# Altium project BLDC Motor Driver.PrjPcb (part 1 of 2)
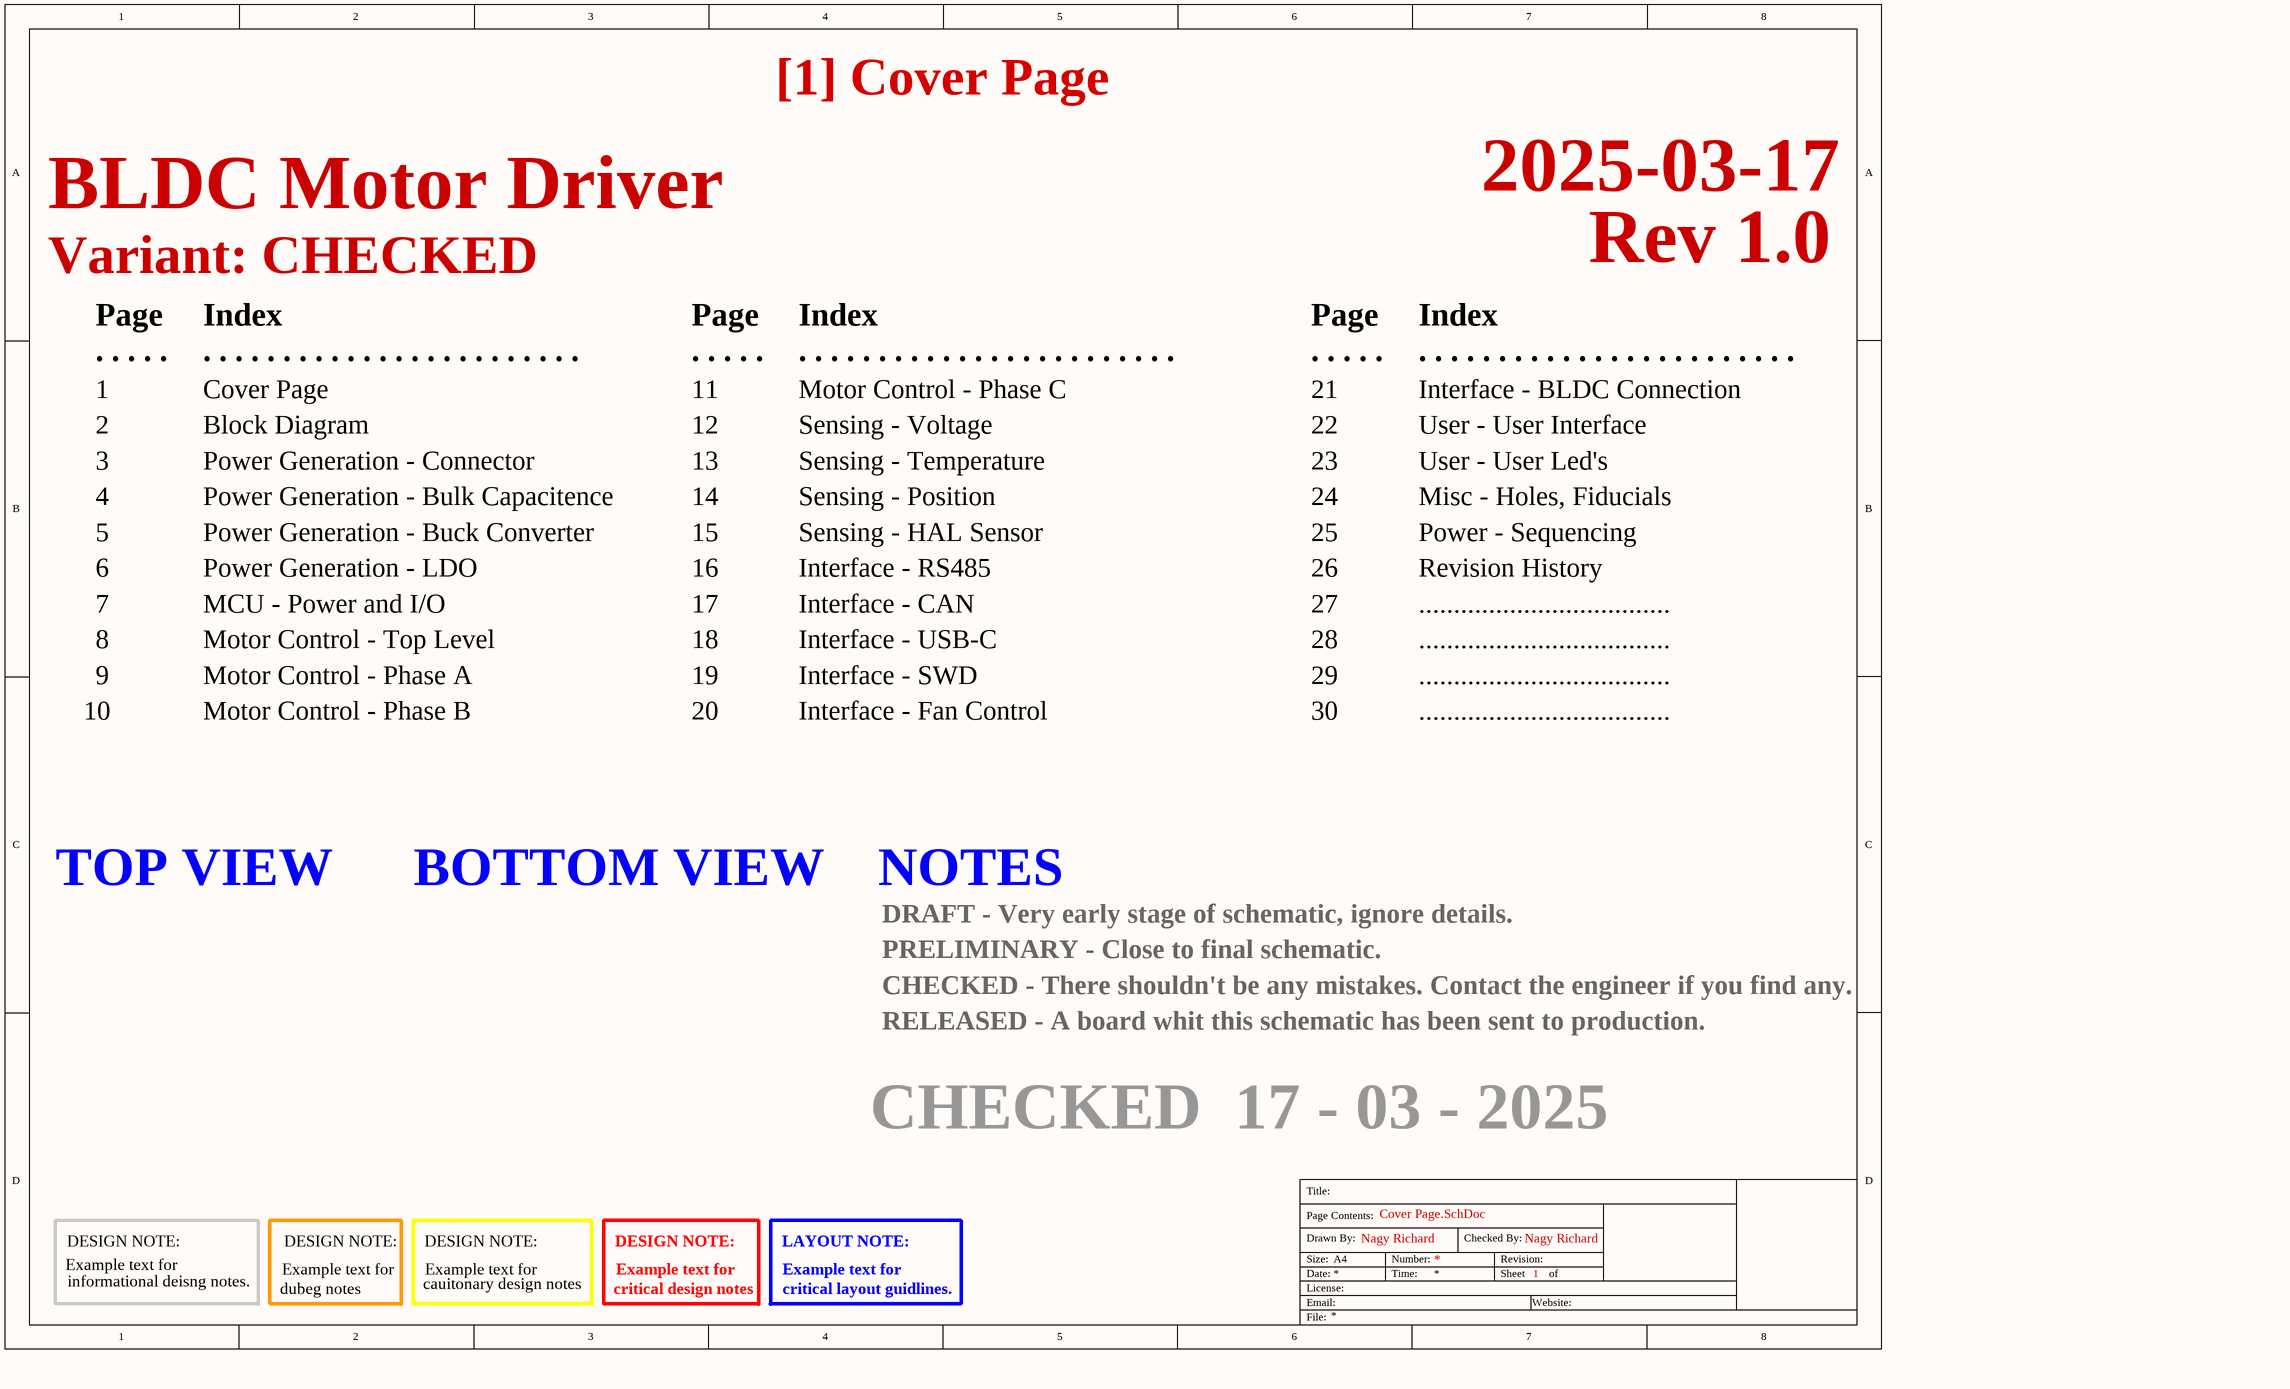
[diagram p0: Cover Page.SchDoc]
24 sheets, 253 parts. Net scope: global (net labels, ports and power ports of the same name join across sheets).
Board file: PCB.PcbDoc
Sheets:
  Cover Page.SchDoc
  Block Diagram.SchDoc
    U_Power Generation - Connector = Power Generation - Connector.SchDoc
    U_Power Generation - Buck Converter = Power Generation - Buck Converter.SchDoc
    U_Power Generation - LDO = Power Generation - LDO.SchDoc
    U_MCU - Power and I_O = MCU - Power and I_O.SchDoc
    U_Motor Control - Top Level = Motor Control - Top Level.SchDoc
    U_Motor Control - Phase A = Motor Control - Phase A.SchDoc
    U_Motor Control - Phase B = Motor Control - Phase B.SchDoc
    U_Motor Control - Phase C = Motor Control - Phase C.SchDoc
    U_Sensing - Voltage = Sensing - Voltage.SchDoc
    U_Sensing - Temperature = Sensing - Temperature.SchDoc
    U_Sensing - HAL Sensor = Sensing - HAL Sensor.SchDoc
    U_Interface - RS485 = Interface - RS485.SchDoc
    U_Interface - CAN = Interface - CAN.SchDoc
    U_Interface - USB-C = Interface - USB-C.SchDoc
    U_Interface - SWD = Interface - SWD.SchDoc
    U_Interface - Fan Control = Interface - Fan Control.SchDoc
    U_Interface - BLDC Connection = Interface - BLDC Connection.SchDoc
    U_User - User Interface = User - User Interface.SchDoc
    U_User - User Led's = User - User Led's.SchDoc
  Misc - Holes, Fiducials.SchDoc
  Power - Sequencing.SchDoc
  Revision History.SchDoc

## Sheet Cover Page.SchDoc: [1] Cover Page
size A3; ApprovedBy: Nagy Richard; CheckedBy: Nagy Richard; Author: Nagy Richard; CompanyName: EmbedCore; DrawnBy: Nagy Richard; Engineer: Nagy Richard; Organization: EmbedCore; Revision: 1.0; SheetNumber: 1; SheetTotal: 24; ImagePath: .\Logo\EmbedCore.png

### Notes on the sheet
- BLDC Motor Driver
- 2025-03-17
- Variant: CHECKED
- Rev 1.0
- Page
- Index
- . . . . .
- 1
- . . . . . . . . . . . . . . . . . . . . . . . .
- Cover Page
- 11
- Motor Control - Phase C
- 21
- Interface - BLDC Connection
- 2
- Block Diagram
- 12
- Sensing - Voltage
- 22
- User - User Interface
- 3
- 4
- Power Generation - Connector
- Power Generation - Bulk Capacitence
- 13
- 14
- Sensing - Temperature
- Sensing - Position
- 23
- 24
- User - User Led's
- Misc - Holes, Fiducials
- 5
- 6
- Power Generation - Buck Converter
- Power Generation - LDO
- 15
- 16
- Sensing - HAL Sensor
- Interface - RS485
- 25
- 26
- Power - Sequencing
- Revision History
- 7
- MCU - Power and I/O
- 17
- Interface - CAN
- 27
- ....................................
- 8
- 9
- Motor Control - Top Level
- Motor Control - Phase A
- 18
- 19
- Interface - USB-C
- Interface - SWD
- 28
- 29
- 10
- Motor Control - Phase B
- 20
- Interface - Fan Control
- 30
- TOP VIEW
- BOTTOM VIEW
- NOTES
- DRAFT - Very early stage of schematic, ignore details.
- CHECKED - There shouldn't be any mistakes. Contact the engineer if you find any.
- PRELIMINARY - Close to final schematic.
- RELEASED - A board whit this schematic has been sent to production.
- CHECKED  17 - 03 - 2025
- DESIGN NOTE:
- LAYOUT NOTE:
- Example text for
- informational deisng notes.
- dubeg notes
- cauitonary design notes
- critical design notes
- critical layout guidlines.
- Title:
- Drawn By:
- Page Contents:
- Checked By:
- Size:
- Date:
- File:
- License:
- Email:
- A4
- Number:
- Time:
- Revision:
- Sheet
- Website:
- of

## Sheet Block Diagram.SchDoc: [2] Block Diagram
size A3; Revision: 1.0; SheetNumber: 2; SheetTotal: 24
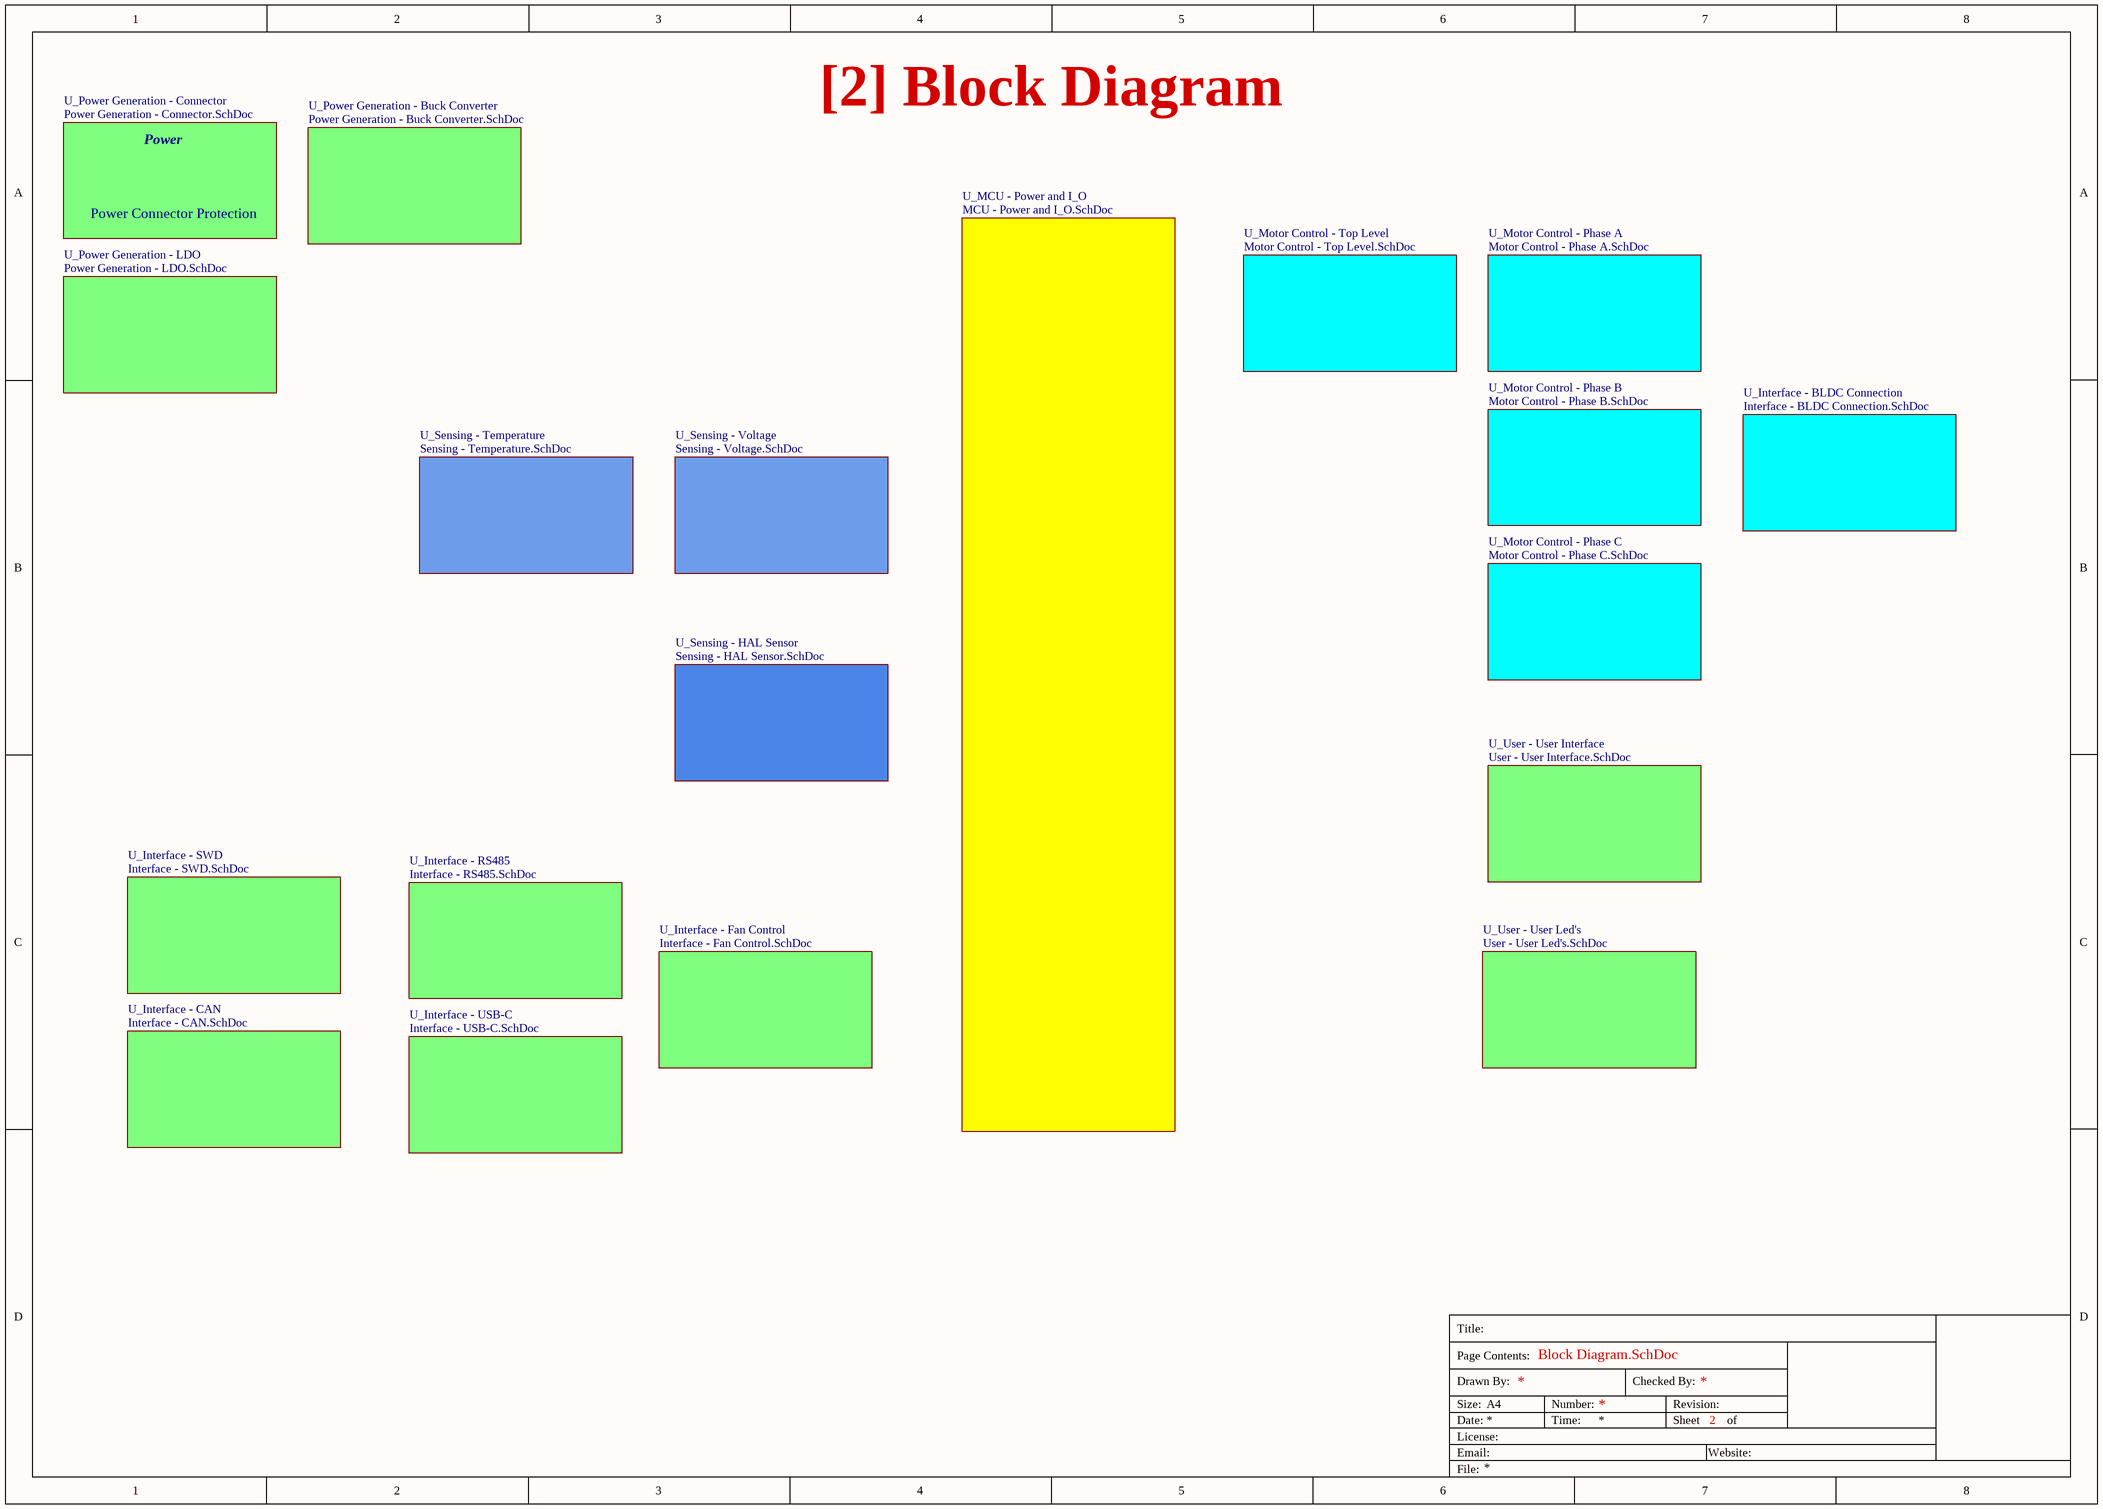
[diagram p1: Block Diagram.SchDoc]

### Sub-sheets
U_Interface - BLDC Connection = Interface - BLDC Connection.SchDoc: no entries
U_Interface - CAN = Interface - CAN.SchDoc: no entries
U_Interface - Fan Control = Interface - Fan Control.SchDoc: no entries
U_Interface - RS485 = Interface - RS485.SchDoc: no entries
U_Interface - SWD = Interface - SWD.SchDoc: no entries
U_Interface - USB-C = Interface - USB-C.SchDoc: no entries
U_MCU - Power and I_O = MCU - Power and I_O.SchDoc: no entries
U_Motor Control - Phase A = Motor Control - Phase A.SchDoc: no entries
U_Motor Control - Phase B = Motor Control - Phase B.SchDoc: no entries
U_Motor Control - Phase C = Motor Control - Phase C.SchDoc: no entries
U_Motor Control - Top Level = Motor Control - Top Level.SchDoc: no entries
U_Power Generation - Buck Converter = Power Generation - Buck Converter.SchDoc: no entries
U_Power Generation - Connector = Power Generation - Connector.SchDoc: no entries
U_Power Generation - LDO = Power Generation - LDO.SchDoc: no entries
U_Sensing - HAL Sensor = Sensing - HAL Sensor.SchDoc: no entries
U_Sensing - Temperature = Sensing - Temperature.SchDoc: no entries
U_Sensing - Voltage = Sensing - Voltage.SchDoc: no entries
U_User - User Interface = User - User Interface.SchDoc: no entries
U_User - User Led's = User - User Led's.SchDoc: no entries

### Notes on the sheet
- Power
- Power Connector Protection
- Title:
- Drawn By:
- Page Contents:
- Checked By:
- Size:
- Date:
- File:
- License:
- Email:
- A4
- Number:
- Time:
- Revision:
- Sheet
- Website:
- of

## Sheet Power Generation - Connector.SchDoc: [3] Power Generation - Connector
size A4; ApprovedBy: Nagy Richard; CheckedBy: Nagy Richard; Author: Nagy Richard; CompanyName: EmbedCore; DrawnBy: Nagy Richard; Engineer: Nagy Richard; Organization: EmbedCore; Revision: 1.0; SheetNumber: 3; SheetTotal: 24
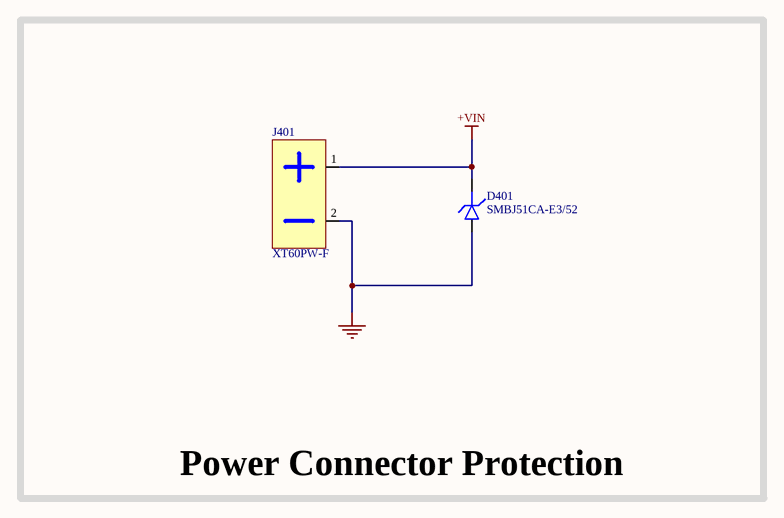
[diagram p2: Power Generation - Connector.SchDoc]

### Parts
D401  SMBJ51CA-E3/52
J401  XT60PW-F  [XT60PW-F]

### Blocks framed on the sheet
Power Connector Protection: D401 J401

### Nets
+VIN: D401.1(K) J401.1(V+)
GND: D401.2(A) J401.2(V-)

### Notes on the sheet
- Title:
- Drawn By:
- Page Contents:
- Checked By:
- Size:
- Date:
- File:
- License:
- Email:
- A4
- Number:
- Time:
- Revision:
- Sheet
- Website:
- of

### Library data of the parts
D401 = D_SMB_TVS
J401 = XT60PW-F: XT60 horizontal female 2-pin AMASS; Manufacturer: AMASS; Manufacturer Part Number: XT60PW-F; Distributor Link: https://www.tme.eu/de/details/xt60pw-f/dc-steckverbinder/amass/

## Sheet Power Generation - Buck Converter.SchDoc: [5] Power Generation - Buck Converter
size A3; ApprovedBy: Nagy Richard; CheckedBy: Nagy Richard; Author: Nagy Richard; CompanyName: EmbedCore; DrawnBy: Nagy Richard; Engineer: Nagy Richard; Revision: 1.0; SheetNumber: 5; SheetTotal: 25
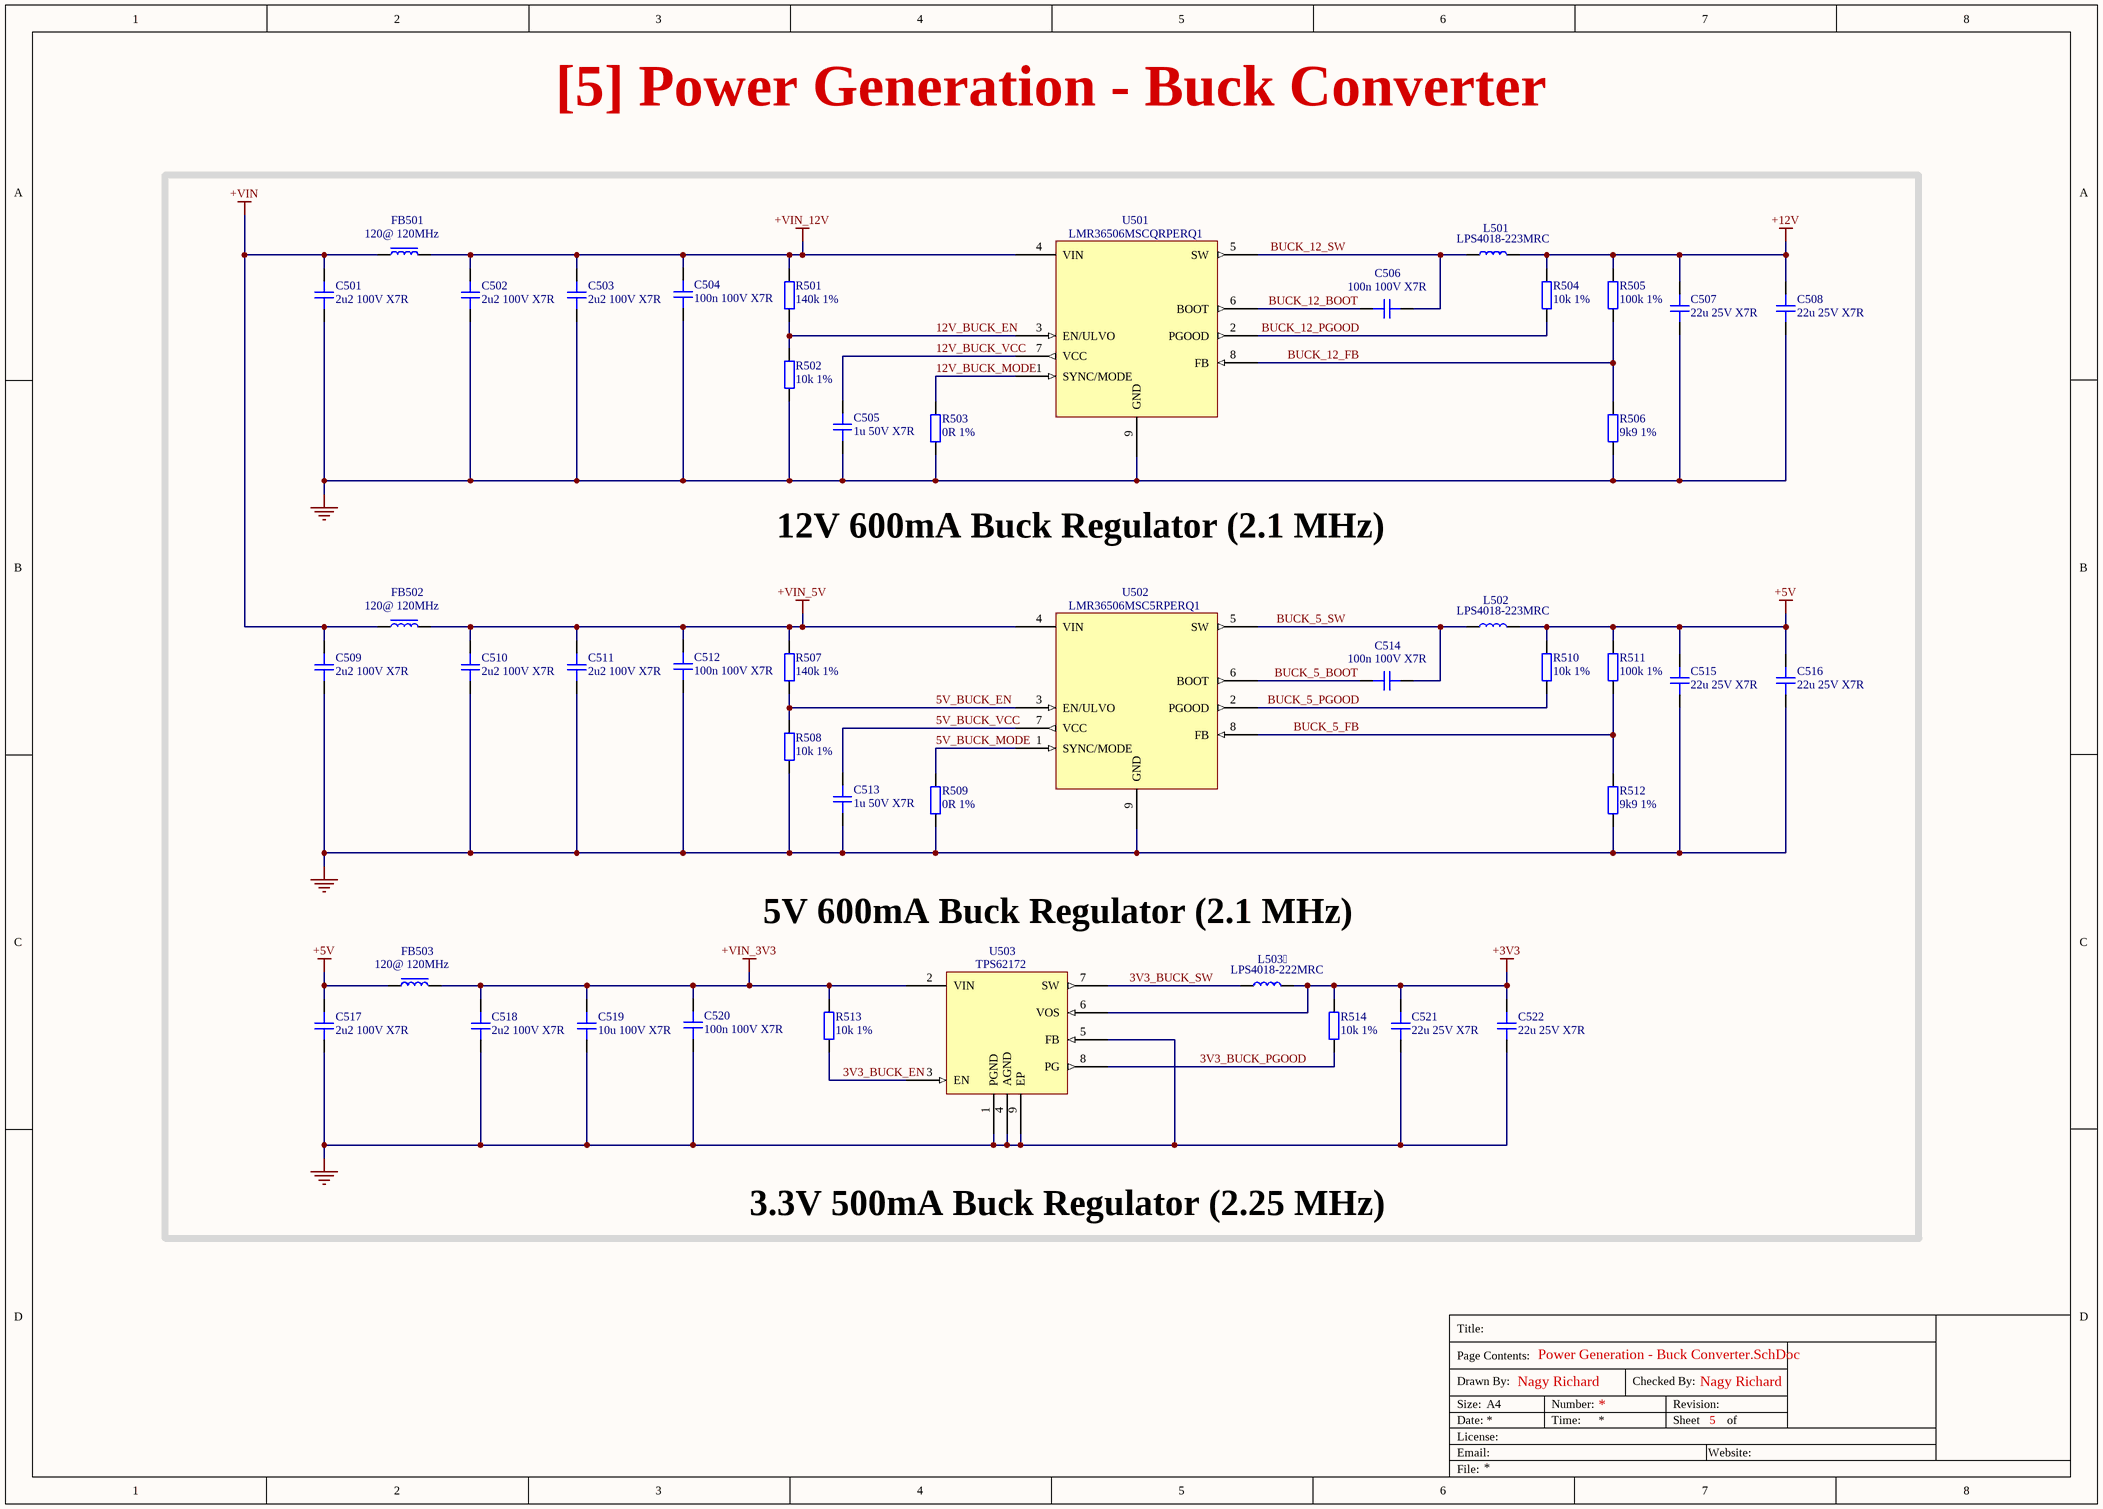
[diagram p3: Power Generation - Buck Converter.SchDoc]

### Parts
C501  2u2 100V X7R  [CAP_1210]
C502  2u2 100V X7R  [CAP_1210]
C503  2u2 100V X7R  [CAP_1210]
C504  100n 100V X7R  [CAP_0805]
C505  1u 50V X7R  [CAP_0603]
C506  100n 100V X7R  [CAP_0805]
C507  22u 25V X7R  [CAP_1210]
C508  22u 25V X7R  [CAP_1210]
C509  2u2 100V X7R  [CAP_1210]
C510  2u2 100V X7R  [CAP_1210]
C511  2u2 100V X7R  [CAP_1210]
C512  100n 100V X7R  [CAP_0805]
C513  1u 50V X7R  [CAP_0603]
C514  100n 100V X7R  [CAP_0805]
C515  22u 25V X7R  [CAP_1210]
C516  22u 25V X7R  [CAP_1210]
C517  2u2 100V X7R  [CAP_1210]
C518  2u2 100V X7R  [CAP_1210]
C519  10u 100V X7R  [CAP_1210]
C520  100n 100V X7R  [CAP_0805]
C521  22u 25V X7R  [CAP_1210]
C522  22u 25V X7R  [CAP_1210]
FB501  120@ 120MHz  [FB_0805]
FB502  120@ 120MHz  [FB_0805]
FB503  120@ 120MHz  [FB_0805]
L501  LPS4018-223MRC  [LPS4018]
L502  LPS4018-223MRC  [LPS4018]
L503  LPS4018-222MRC  [LPS4018]
R501  140k 1%  [RES_0603]
R502  10k 1%  [RES_0603]
R503  0R 1%  [RES_0603]
R504  10k 1%  [RES_0603]
R505  100k 1%  [RES_0603]
R506  9k9 1%  [RES_0603]
R507  140k 1%  [RES_0603]
R508  10k 1%  [RES_0603]
R509  0R 1%  [RES_0603]
R510  10k 1%  [RES_0603]
R511  100k 1%  [RES_0603]
R512  9k9 1%  [RES_0603]
R513  10k 1%  [RES_0603]
R514  10k 1%  [RES_0603]
U501  LMR36506MSCQRPERQ1  [LMR36506MSC5RPERQ1]
U502  LMR36506MSC5RPERQ1  [LMR36506MSC5RPERQ1]
U503  TPS62172  [SON50P200X200X80-9N]

### Nets
+3V3: C521.2 C522.2 L503.2 R514.2 U503.6(VOS)
+5V: C515.2 C516.2 C517.2 FB503.1 L502.2 R510.2 R511.2
+12V: C507.2 C508.2 L501.2 R504.2 R505.2
+VIN: C501.2 C509.2 FB501.1 FB502.1
+VIN_3V3: C518.2 C519.2 C520.2 FB503.2 R513.2 U503.2(VIN)
+VIN_5V: C510.2 C511.2 C512.2 FB502.2 R507.2 U502.4(VIN)
+VIN_12V: C502.2 C503.2 C504.2 FB501.2 R501.2 U501.4(VIN)
GND: C501.1 C502.1 C503.1 C504.1 C505.1 C507.1 C508.1 C509.1 C510.1 C511.1 C512.1 C513.1 C515.1 C516.1 C517.1 C518.1 C519.1 C520.1 C521.1 C522.1 R502.1 R503.1 R506.1 R508.1 R509.1 R512.1 U501.9(GND) U502.9(GND) U503.1(PGND) U503.4(AGND) U503.5(FB) U503.9(EP)
3V3_BUCK_EN: R513.1 U503.3(EN)
3V3_BUCK_PGOOD: R514.1 U503.8(PG)
3V3_BUCK_SW: L503.1 U503.7(SW)
5V_BUCK_EN: R507.1 R508.2 U502.3(EN/ULVO)
5V_BUCK_MODE: R509.2 U502.1(SYNC/MODE)
5V_BUCK_VCC: C513.2 U502.7(VCC)
12V_BUCK_EN: R501.1 R502.2 U501.3(EN/ULVO)
12V_BUCK_MODE: R503.2 U501.1(SYNC/MODE)
12V_BUCK_VCC: C505.2 U501.7(VCC)
BUCK_5_BOOT: C514.2 U502.6(BOOT)
BUCK_5_FB: R511.1 R512.2 U502.8(FB)
BUCK_5_PGOOD: R510.1 U502.2(PGOOD)
BUCK_5_SW: C514.1 L502.1 U502.5(SW)
BUCK_12_BOOT: C506.2 U501.6(BOOT)
BUCK_12_FB: R505.1 R506.2 U501.8(FB)
BUCK_12_PGOOD: R504.1 U501.2(PGOOD)
BUCK_12_SW: C506.1 L501.1 U501.5(SW)

### Notes on the sheet
- 12V 600mA Buck Regulator (2.1 MHz)
- 5V 600mA Buck Regulator (2.1 MHz)
- 3.3V 500mA Buck Regulator (2.25 MHz)
- Title:
- Drawn By:
- Page Contents:
- Checked By:
- Size:
- Date:
- File:
- License:
- Email:
- A4
- Number:
- Time:
- Revision:
- Sheet
- Website:
- of

### Library data of the parts
C501-C503 C509-C511 C517 C518 = CAP_1210: Capacitor SMD 1210; Manufacturer: Taiyo Yuden; Manufacturer Part Number: HMK325B7225KM-P; Distributor Link: www.lcsc.com; LCSC: C385983; Rating: *; Dielectric: *
C504 C506 C512 C514 C520 = CAP_0805: Capacitor SMD 0805; Manufacturer: HUI JU; Manufacturer Part Number: NM0805B104K101CEDN; Distributor Link: www.lcsc.com; LCSC: C710457; Rating: *; Dielectric: *
C505 C513 = CAP_0603: Capacitor SMD 0603; Manufacturer: YAGEO; Manufacturer Part Number: CC0603KRX7R9BB105; Distributor Link: www.lcsc.com; LCSC: C559769; Rating: *; Dielectric: *
C507 C508 C515 C516 C521 C522 = CAP_1210: Capacitor SMD 1210; Manufacturer: Samwha Capacitor; Manufacturer Part Number: CS3225X7R226K250NRL; Distributor Link: www.lcsc.com; LCSC: C2918511; Rating: *; Dielectric: *
C519 = CAP_1210: Capacitor SMD 1210; Manufacturer: PSA(Prosperity Dielectrics); Manufacturer Part Number: FS32X106K101EGG; Distributor Link: www.lcsc.com; LCSC: C5156756; Rating: *; Dielectric: *
FB501-FB503 = FB_0805: Ferrite Bead SMD 0805; Manufacturer: Murata Electronics; Manufacturer Part Number: BLM21AG121SN1D; Distributor Link: www.lcsc.com; LCSC: C88990
L501 L502 L503 = LPS4018: Shielded Power Inductors – LPS4018
R501 R502 R504 R507 R508 R510 R513 R514 = RES_0603: Resistor SMD 0603; Manufacturer: YAGEO; Manufacturer Part Number: RC0603FR-07140KL; Distributor Link: www.lcsc.com; LCSC: C185372
R503 R509 = RES_0603: Resistor SMD 0603; Manufacturer: YAGEO; Manufacturer Part Number: AC0603FR-070RL; Distributor Link: www.lcsc.com; LCSC: C116699
R505 R511 = RES_0603: Resistor SMD 0603; Manufacturer: YAGEO; Manufacturer Part Number: RC0603FR-07100KL; Distributor Link: www.lcsc.com; LCSC: C14675
R506 R512 = RES_0603: Resistor SMD 0603; Manufacturer: TBD; Manufacturer Part Number: TBD; Distributor Link: www.lcsc.com; LCSC: TBD
U501 U502 = LMR36506MSC5RPERQ1: LMR36506-Q1 3-V to 65-V, 0.6-A Synchronous Buck Converter Optimized for Size and / Light Load Efficiency / 5V Output
U503 = TPS62172: TPS6217x-Q1 3-V to17-V 0.5-A Step-Down Converters with DCS-Control™

## Sheet Power Generation - LDO.SchDoc: [6] Power Generation - LDO
size A4; ApprovedBy: Nagy Richard; CheckedBy: Power Generation - LDO; Author: Power Generation - LDO; CompanyName: EmbedCore; DrawnBy: Power Generation - LDO; Engineer: Power Generation - LDO; Organization: EmbedCore; Revision: 1.0; SheetNumber: 6; SheetTotal: 7
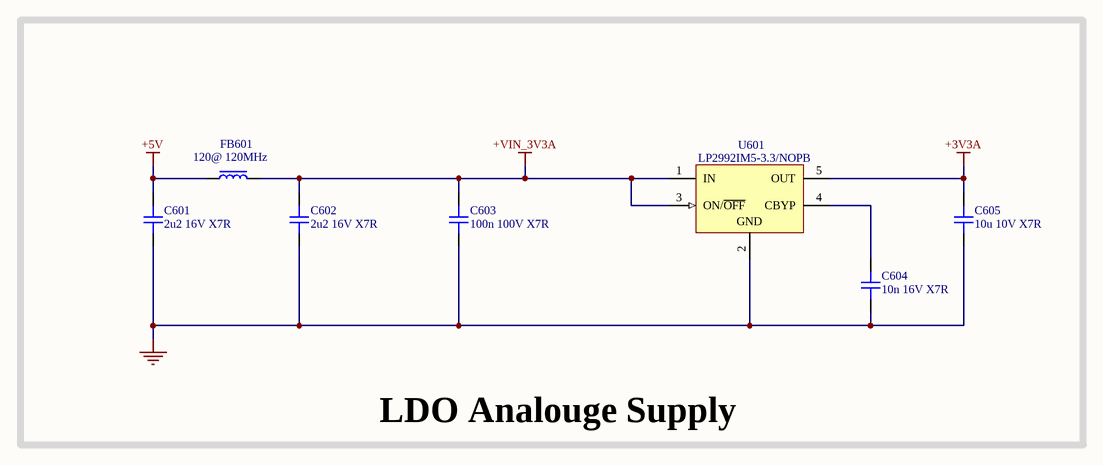
[diagram p4: Power Generation - LDO.SchDoc]

### Parts
C601  2u2 16V X7R  [CAP_0805]
C602  2u2 16V X7R  [CAP_0805]
C603  100n 100V X7R  [CAP_0805]
C604  10n 16V X7R  [CAP_0603]
C605  10u 10V X7R  [CAP_0805]
FB601  120@ 120MHz  [FB_0805]
U601  LP2992IM5-3.3/NOPB  [DBV0005A_L]

### Blocks framed on the sheet
LDO Analouge Supply: C601-C605 FB601 U601

### Nets
+3V3A: C605.1 U601.5(OUT)
+5V: C601.1 FB601.1
+VIN_3V3A: C602.1 C603.1 FB601.2 U601.1(IN) U601.3(ON/~{OFF})
GND: C601.2 C602.2 C603.2 C604.1 C605.2 U601.2(GND)
NetC604_2: C604.2 U601.4(CBYP)

### Notes on the sheet
- Title:
- Drawn By:
- Page Contents:
- Checked By:
- Size:
- Date:
- File:
- License:
- Email:
- A4
- Number:
- Time:
- Revision:
- Sheet
- Website:
- of

### Library data of the parts
C601 C602 = CAP_0805: Capacitor SMD 0805; Manufacturer: HRE; Manufacturer Part Number: CGA0805X7R225K160MT; Distributor Link: www.lcsc.com; LCSC: C6119936; Rating: *; Dielectric: *
C603 = CAP_0805: Capacitor SMD 0805; Manufacturer: YAGEO; Manufacturer Part Number: CC0805JRX7R7BB104; Distributor Link: www.lcsc.com; LCSC: CC0805JRX7R7BB104; Rating: *; Dielectric: *
C604 = CAP_0603: Capacitor SMD 0603; Manufacturer: YAGEO; Manufacturer Part Number: CC0603JRX7R7BB103; Distributor Link: www.lcsc.com; LCSC: C519509; Rating: *; Dielectric: *
C605 = CAP_0805: Capacitor SMD 0805; Manufacturer: Murata Electronics; Manufacturer Part Number: GCM21BR71A106KE22K; Distributor Link: www.lcsc.com; LCSC: C2167756; Rating: *; Dielectric: *
FB601 = FB_0805: as FB501 on sheet Power Generation - Buck Converter; Distributor Link: www.lcsc.com; LCSC: C88990
U601 = CMP-0062-02175-3: Micropower 250 mA Low-Noise Ultra Low-Dropout Regulator, 5-pin SOT-23, Pb-Free; Manufacturer: Texas Instruments; CompType: LDO IC; PackageTopMarking: LFEB*XTT; PowerWise: N; PackageReference: DBV0005A; ComponentLink1Description: Datasheet URL; RoHS: Y; PackageDescription: Molded SOT-23, .115 x .063 x .040 in Body, 5 Lead, .0375 in Pitch; ComponentLink1URL: http://www.ti.com/general/docs/lit/getliterature.tsp?genericPartNumber=LP2992&fileType=pdf; PinCount: 5

## Sheet MCU - Power and I_O.SchDoc: [7] MCU - Power
size A4; ApprovedBy: Nagy Richard; CheckedBy: Nagy Richard; Author: Nagy Richard; CompanyName: EmbedCore; DrawnBy: Nagy Richard; Engineer: Nagy Richard; Organization: EmbedCore; Revision: 1.0; SheetNumber: 7; SheetTotal: 25
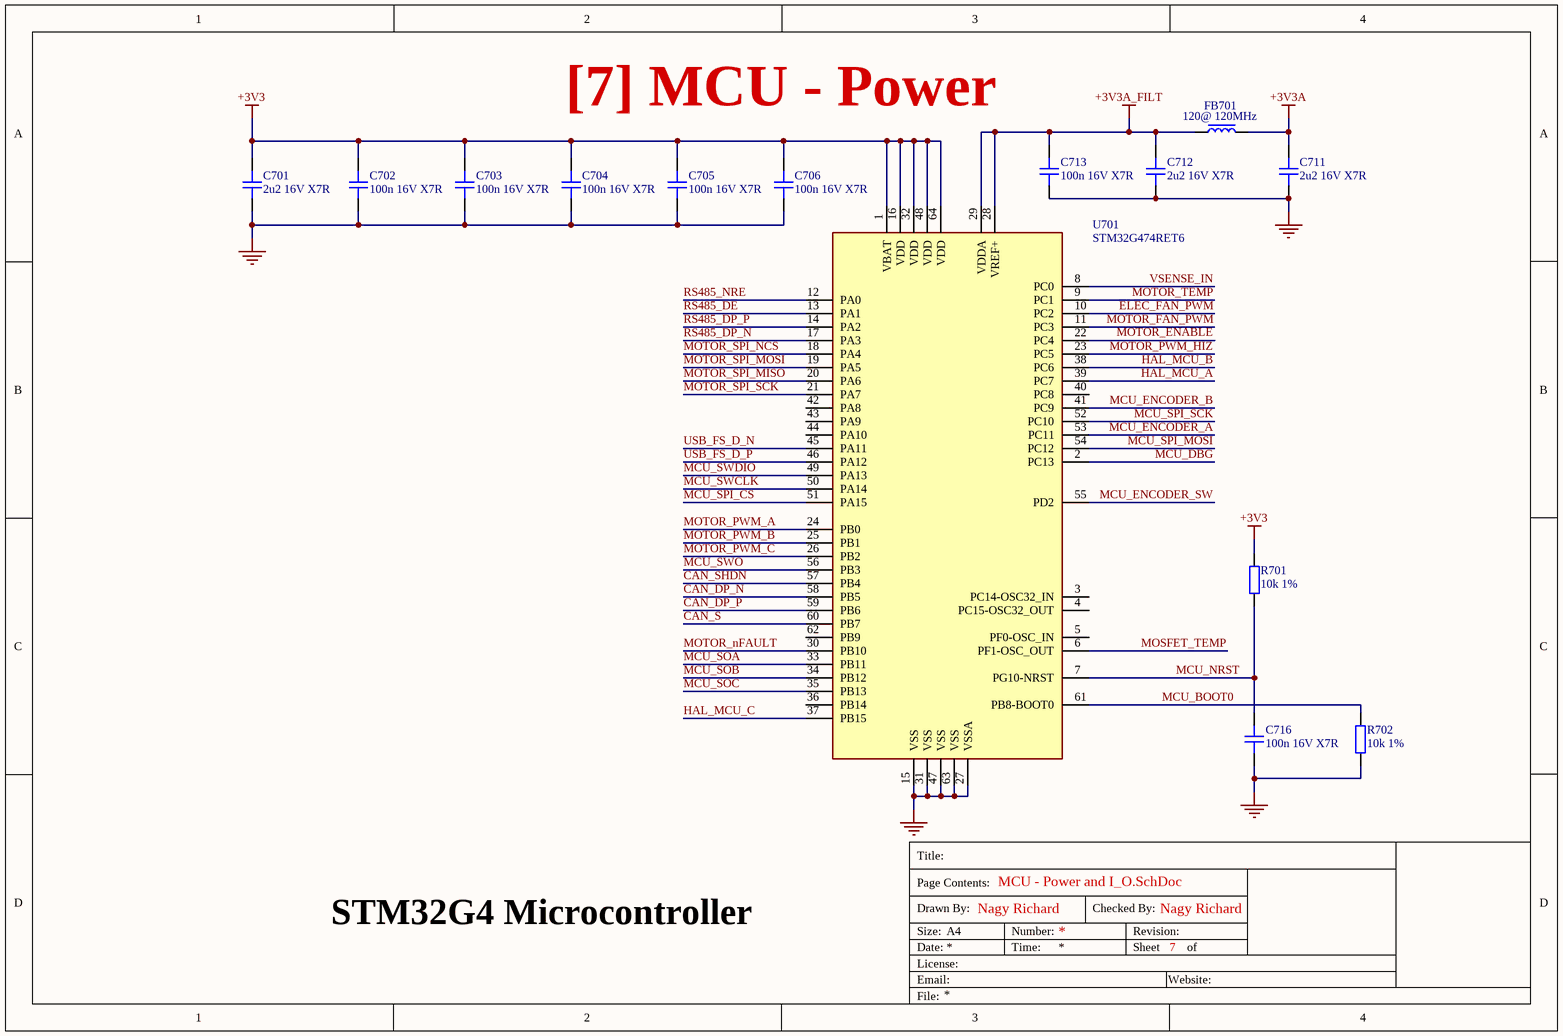
[diagram p5: MCU - Power and I_O.SchDoc]

### Parts
C701  2u2 16V X7R  [CAP_0603]
C702  100n 16V X7R  [CAP_0402]
C703  100n 16V X7R  [CAP_0402]
C704  100n 16V X7R  [CAP_0402]
C705  100n 16V X7R  [CAP_0402]
C706  100n 16V X7R  [CAP_0402]
C711  2u2 16V X7R  [CAP_0603]
C712  2u2 16V X7R  [CAP_0603]
C713  100n 16V X7R  [CAP_0402]
C716  100n 16V X7R  [CAP_0402]
FB701  120@ 120MHz  [FB_0603]
R701  10k 1%  [RES_0402]
R702  10k 1%  [RES_0402]
U701  STM32G474RET6  [QFP50P1200X1200X160-64N]

### Nets
+3V3: C701.2 C702.2 C703.2 C704.2 C705.2 C706.2 R701.2 U701.1(VBAT) U701.16(VDD) U701.32(VDD) U701.48(VDD) U701.64(VDD)
+3V3A: C711.2 FB701.2
+3V3A_FILT: C712.2 C713.2 FB701.1 U701.28(VREF+) U701.29(VDDA)
GND: C701.1 C702.1 C703.1 C704.1 C705.1 C706.1 C711.1 C712.1 C713.1 C716.1 R702.1 U701.15(VSS) U701.27(VSSA) U701.31(VSS) U701.47(VSS) U701.63(VSS)
CAN_DP_N: U701.58(PB5)
CAN_DP_P: U701.59(PB6)
CAN_S: U701.60(PB7)
CAN_SHDN: U701.57(PB4)
ELEC_FAN_PWM: U701.10(PC2)
HAL_MCU_A: U701.39(PC7)
HAL_MCU_B: U701.38(PC6)
HAL_MCU_C: U701.37(PB15)
MCU_BOOT0: R702.2 U701.61(PB8-BOOT0)
MCU_DBG: U701.2(PC13)
MCU_ENCODER_A: U701.53(PC11)
MCU_ENCODER_B: U701.41(PC9)
MCU_ENCODER_SW: U701.55(PD2)
MCU_NRST: C716.2 R701.1 U701.7(PG10-NRST)
MCU_SOA: U701.33(PB11)
MCU_SOB: U701.34(PB12)
MCU_SOC: U701.35(PB13)
MCU_SPI_CS: U701.51(PA15)
MCU_SPI_MOSI: U701.54(PC12)
MCU_SPI_SCK: U701.52(PC10)
MCU_SWCLK: U701.50(PA14)
MCU_SWDIO: U701.49(PA13)
MCU_SWO: U701.56(PB3)
MOSFET_TEMP: U701.6(PF1-OSC_OUT)
MOTOR_ENABLE: U701.22(PC4)
MOTOR_FAN_PWM: U701.11(PC3)
MOTOR_nFAULT: U701.30(PB10)
MOTOR_PWM_A: U701.24(PB0)
MOTOR_PWM_B: U701.25(PB1)
MOTOR_PWM_C: U701.26(PB2)
MOTOR_PWM_HIZ: U701.23(PC5)
MOTOR_SPI_MISO: U701.20(PA6)
MOTOR_SPI_MOSI: U701.19(PA5)
MOTOR_SPI_NCS: U701.18(PA4)
MOTOR_SPI_SCK: U701.21(PA7)
MOTOR_TEMP: U701.9(PC1)
RS485_DE: U701.13(PA1)
RS485_DP_N: U701.17(PA3)
RS485_DP_P: U701.14(PA2)
RS485_NRE: U701.12(PA0)
USB_FS_D_N: U701.45(PA11)
USB_FS_D_P: U701.46(PA12)
VSENSE_IN: U701.8(PC0)

Not connected (* = marked no-connect by the designer): U701 3(PC14-OSC32_IN) 4(PC15-OSC32_OUT) 5(PF0-OSC_IN) 36(PB14) 40(PC8) 42(PA8) 43(PA9) 44(PA10) 62(PB9)

### Notes on the sheet
- STM32G4 Microcontroller
- Title:
- Drawn By:
- Page Contents:
- Checked By:
- Size:
- Date:
- File:
- License:
- Email:
- A4
- Number:
- Time:
- Revision:
- Sheet
- Website:
- of

### Library data of the parts
C701 C711 C712 = CAP_0603: Capacitor SMD 0603; Manufacturer: YAGEO; Manufacturer Part Number: CC0603KRX7R7BB225; Distributor Link: www.lcsc.com; LCSC: C914769; Rating: *; Dielectric: *
C702-C706 C713 C716 = CAP_0402: Capacitor SMD 0402; Manufacturer: YAGEO; Manufacturer Part Number: CC0402JRX7R7BB104; Distributor Link: www.lcsc.com; LCSC: C541464; Rating: *; Dielectric: *
FB701 = FB_0603: Ferrite Bead SMD 0603; Manufacturer: TDK; Manufacturer Part Number: MMZ1608S121ATD25; Distributor Link: www.lcsc.com; LCSC: C2661467
R701 R702 = RES_0402: Resistor SMD 0402; Manufacturer: PANASONIC; Manufacturer Part Number: ERJPA2F1002X; Distributor Link: www.lcsc.com; LCSC: C427247
U701 = STM32G474RET6: ARM Microcontrollers - MCU Mainstream Arm Cortex-M4 MCU 170 MHz 512 Kbytes of Flash Math Accel, HR Timer, H; Manufacturer: *; Manufacturer Part Number: *; LCSC: *

## Sheet Motor Control - Top Level.SchDoc: [8] Motor Control - Top Level
size A4; ApprovedBy: Nagy Richard; CheckedBy: Nagy Richard; Author: Nagy Richard; CompanyName: EmbedCore; DrawnBy: Nagy Richard; Engineer: Nagy Richard; Organization: EmbedCore; Revision: 1.0; SheetNumber: 8; SheetTotal: 25
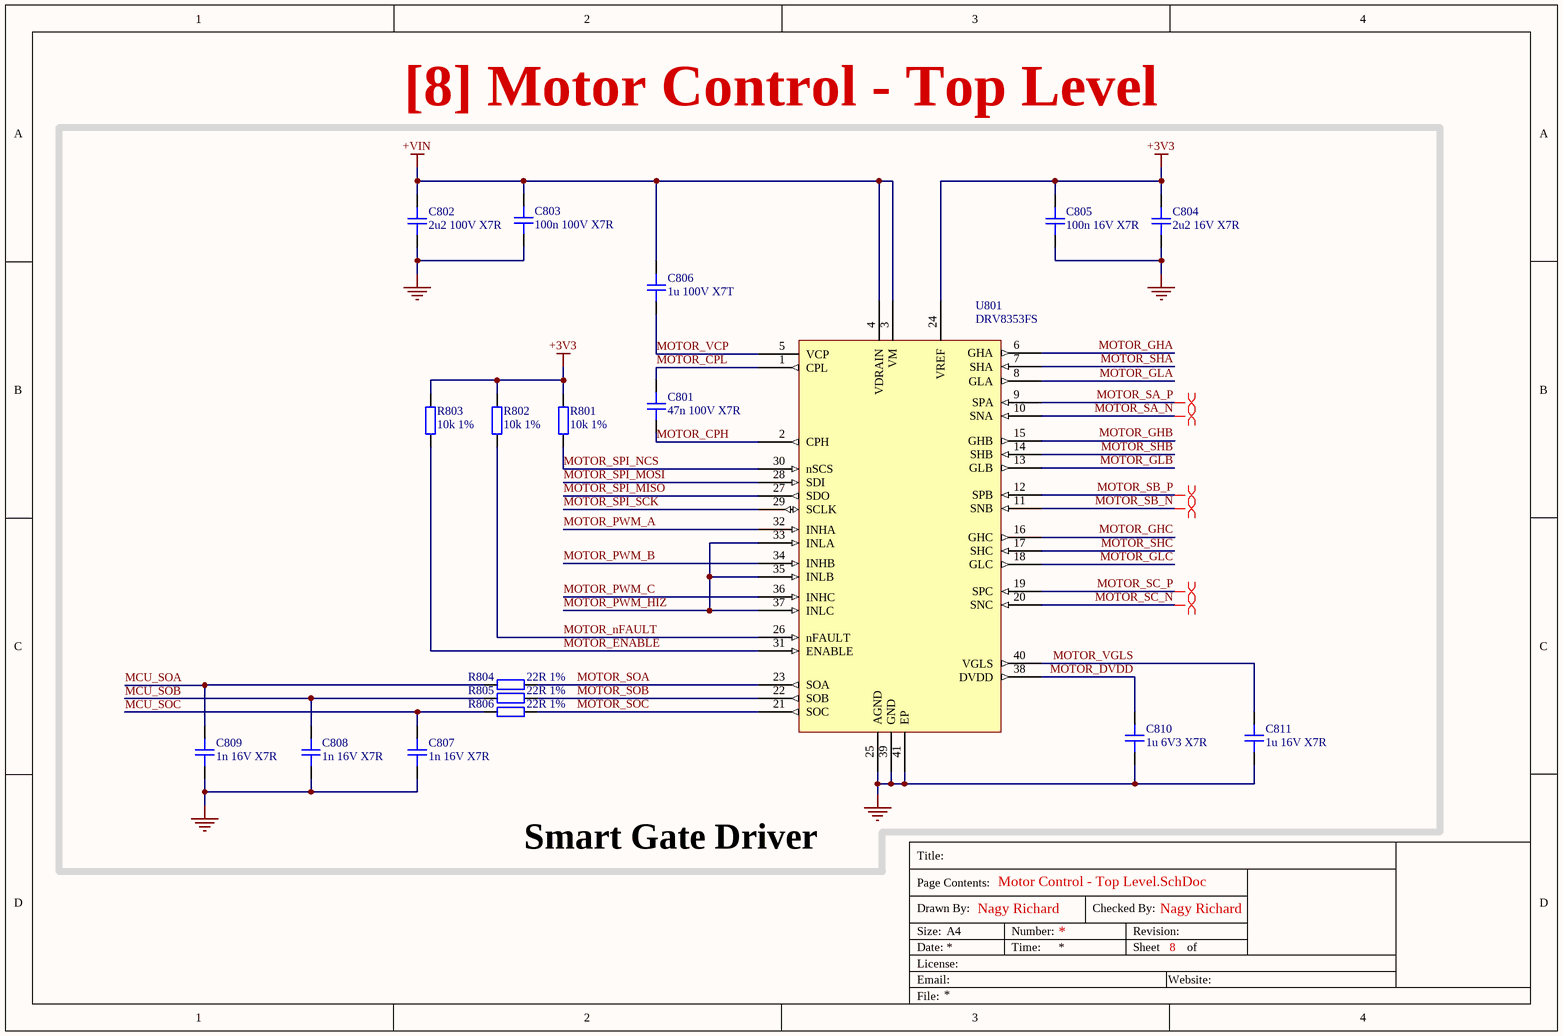
[diagram p6: Motor Control - Top Level.SchDoc]

### Parts
C801  47n 100V X7R  [CAP_0603]
C802  2u2 100V X7R  [CAP_0805]
C803  100n 100V X7R  [CAP_0603]
C804  2u2 16V X7R  [CAP_0603]
C805  100n 16V X7R  [CAP_0402]
C806  1u 100V X7T  [CAP_0603]
C807  1n 16V X7R  [CAP_0402]
C808  1n 16V X7R  [CAP_0402]
C809  1n 16V X7R  [CAP_0402]
C810  1u 6V3 X7R  [CAP_0603]
C811  1u 16V X7R  [CAP_0603]
R801  10k 1%  [RES_0402]
R802  10k 1%  [RES_0402]
R803  10k 1%  [RES_0402]
R804  22R 1%  [RES_0402]
R805  22R 1%  [RES_0402]
R806  22R 1%  [RES_0402]
U801  DRV8353FS  [QFN50P600X600X80-41N-D]

### Blocks framed on the sheet
Smart Gate Driver: C801-C811 R801-R806 U801

### Nets
+3V3: C804.2 C805.2 R801.2 R802.2 R803.2 U801.24(VREF)
+VIN: C802.2 C803.2 C806.2 U801.3(VM) U801.4(VDRAIN)
GND: C802.1 C803.1 C804.1 C805.1 C807.1 C808.1 C809.1 C810.1 C811.1 U801.25(AGND) U801.39(GND) U801.41(EP)
MCU_SOA: C809.2 R804.2
MCU_SOB: C808.2 R805.2
MCU_SOC: C807.2 R806.2
MOTOR_CPH: C801.1 U801.2(CPH)
MOTOR_CPL: C801.2 U801.1(CPL)
MOTOR_DVDD: C810.2 U801.38(DVDD)
MOTOR_ENABLE: R803.1 U801.31(ENABLE)
MOTOR_GHA: U801.6(GHA)
MOTOR_GHB: U801.15(GHB)
MOTOR_GHC: U801.16(GHC)
MOTOR_GLA: U801.8(GLA)
MOTOR_GLB: U801.13(GLB)
MOTOR_GLC: U801.18(GLC)
MOTOR_nFAULT: R802.1 U801.26(nFAULT)
MOTOR_PWM_A: U801.32(INHA)
MOTOR_PWM_B: U801.34(INHB)
MOTOR_PWM_C: U801.36(INHC)
MOTOR_PWM_HIZ: U801.33(INLA) U801.35(INLB) U801.37(INLC)
MOTOR_SA_N: U801.10(SNA)
MOTOR_SA_P: U801.9(SPA)
MOTOR_SB_N: U801.11(SNB)
MOTOR_SB_P: U801.12(SPB)
MOTOR_SC_N: U801.20(SNC)
MOTOR_SC_P: U801.19(SPC)
MOTOR_SHA: U801.7(SHA)
MOTOR_SHB: U801.14(SHB)
MOTOR_SHC: U801.17(SHC)
MOTOR_SOA: R804.1 U801.23(SOA)
MOTOR_SOB: R805.1 U801.22(SOB)
MOTOR_SOC: R806.1 U801.21(SOC)
MOTOR_SPI_MISO: U801.27(SDO)
MOTOR_SPI_MOSI: U801.28(SDI)
MOTOR_SPI_NCS: R801.1 U801.30(nSCS)
MOTOR_SPI_SCK: U801.29(SCLK)
MOTOR_VCP: C806.1 U801.5(VCP)
MOTOR_VGLS: C811.2 U801.40(VGLS)

### Layout directives
differential pair: MOTOR_SA_N, MOTOR_SA_P, MOTOR_SB_N, MOTOR_SB_P, MOTOR_SC_N, MOTOR_SC_P

### Notes on the sheet
- Title:
- Drawn By:
- Page Contents:
- Checked By:
- Size:
- Date:
- File:
- License:
- Email:
- A4
- Number:
- Time:
- Revision:
- Sheet
- Website:
- of

### Library data of the parts
C801 = CAP_0603: Capacitor SMD 0603; Manufacturer: YAGEO; Manufacturer Part Number: CC0603KRX7R0BB473; Distributor Link: www.lcsc.com; LCSC: C576852; Rating: *; Dielectric: *
C802 = CAP_0805: Capacitor SMD 0805; Manufacturer: HRE; Manufacturer Part Number: CGA0805X7R225K101MT; Distributor Link: www.lcsc.com; LCSC: C6119935; Rating: *; Dielectric: *
C803 = CAP_0603: Capacitor SMD 0603; Manufacturer: YAGEO; Manufacturer Part Number: AC0603KRX7R0BB104; Distributor Link: www.lcsc.com; LCSC: C408909; Rating: *; Dielectric: *
C804 = CAP_0603: as C701 on sheet MCU - Power and I_O; Distributor Link: www.lcsc.com; LCSC: C914769; Rating: *; Dielectric: *
C805 = CAP_0402: as C702 on sheet MCU - Power and I_O; Distributor Link: www.lcsc.com; LCSC: C541464; Rating: *; Dielectric: *
C806 = CAP_0603: Capacitor SMD 0603; Manufacturer: Murata Electronics; Manufacturer Part Number: GRM188D72A105KE01D; Distributor Link: www.lcsc.com; LCSC: C23829972; Rating: *; Dielectric: *
C807-C809 = CAP_0402: Capacitor SMD 0402; Manufacturer: YAGEO; Manufacturer Part Number: AC0402KRX7R7BB102; Distributor Link: www.lcsc.com; LCSC: C726514; Rating: *; Dielectric: *
C810 = CAP_0603: Capacitor SMD 0603; Manufacturer: YAGEO; Manufacturer Part Number: CC0603KRX7R5BB105; Distributor Link: www.lcsc.com; LCSC: C309479; Rating: *; Dielectric: *
C811 = CAP_0603: Capacitor SMD 0603; Manufacturer: Murata Electronics; Manufacturer Part Number: GRM188R71C105ME15D; Distributor Link: www.lcsc.com; LCSC: C723883; Rating: *; Dielectric: *
R801-R803 = RES_0402: as R701 on sheet MCU - Power and I_O; Distributor Link: www.lcsc.com; LCSC: C427247
R804-R806 = RES_0402: Resistor SMD 0402; Manufacturer: PANASONIC; Manufacturer Part Number: ERJPA2F22R0X; Distributor Link: www.lcsc.com; LCSC: C427230
U801 = DRV8353FS: DRV835xF 100-V Three-Phase Smart Gate Driver; Manufacturer: *; Manufacturer Part Number: *; Distributor Link: *; LCSC: *

## Sheet Motor Control - Phase A.SchDoc: [9] Motor Control - Phase A
size A4; ApprovedBy: Nagy Richard; CheckedBy: Nagy Richard; Author: Nagy Richard; CompanyName: EmbedCore; DrawnBy: Nagy Richard; Engineer: Nagy Richard; Organization: EmbedCore; Revision: 1.0; SheetNumber: 9; SheetTotal: 25
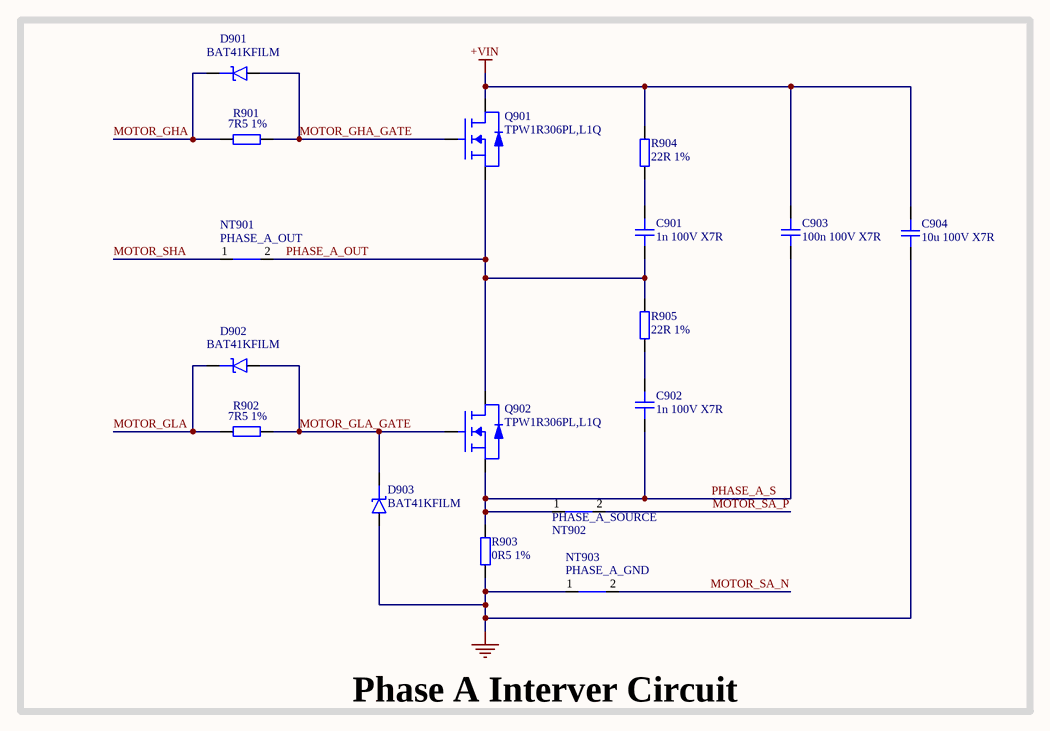
[diagram p7: Motor Control - Phase A.SchDoc]

### Parts
C901  1n 100V X7R  [CAP_0805]
C902  1n 100V X7R  [CAP_0805]
C903  100n 100V X7R  [CAP_1206]
C904  10u 100V X7R  [CAP_1210]
D901  BAT41KFILM  [SOD-523]
D902  BAT41KFILM  [SOD-523]
D903  BAT41KFILM  [SOD-523]
NT901  PHASE_A_OUT  [NETTIE_SMD]  (net tie, no BOM)
NT902  PHASE_A_SOURCE  [NETTIE_SMD]  (net tie, no BOM)
NT903  PHASE_A_GND  [NETTIE_SMD]  (net tie, no BOM)
Q901  TPW1R306PL,L1Q  [PowerPAK-SO-8]
Q902  TPW1R306PL,L1Q  [PowerPAK-SO-8]
R901  7R5 1%  [RES_0603]
R902  7R5 1%  [RES_0603]
R903  0R5 1%  [RES_1206]
R904  22R 1%  [RES_0805]
R905  22R 1%  [RES_0805]

### Blocks framed on the sheet
Phase A Interver Circuit: C901-C904 D901-D903 NT901-NT903 Q901 Q902 R901-R905

### Nets
+VIN: C903.2 C904.2 Q901.D R904.2
GND: C904.1 D903.A NT903.1 R903.1
MOTOR_GHA: D901.K R901.1
MOTOR_GHA_GATE: D901.A Q901.G R901.2
MOTOR_GLA: D902.K R902.1
MOTOR_GLA_GATE: D902.A D903.K Q902.G R902.2
MOTOR_SA_N: NT903.2
MOTOR_SA_P: NT902.2
MOTOR_SHA: NT901.1
PHASE_A_OUT: C901.1 NT901.2 Q901.S Q902.D R905.2
PHASE_A_S: C902.1 C903.1 NT902.1 Q902.S R903.2
NetC901_2: C901.2 R904.1
NetC902_2: C902.2 R905.1

### Notes on the sheet
- Title:
- Drawn By:
- Page Contents:
- Checked By:
- Size:
- Date:
- File:
- License:
- Email:
- A4
- Number:
- Time:
- Revision:
- Sheet
- Website:
- of

### Library data of the parts
C901 C902 = CAP_0805: Capacitor SMD 0805; Manufacturer: Kyocera AVX; Manufacturer Part Number: 08051C102JAT2A; Distributor Link: www.lcsc.com; LCSC: C2169492; Rating: *; Dielectric: *
C903 = CAP_1206: Capacitor SMD 1206; Manufacturer: YAGEO; Manufacturer Part Number: CC1206JKX7R0BB104; Distributor Link: www.lcsc.com; LCSC: C726629; Rating: *; Dielectric: *
C904 = CAP_1210: as C519 on sheet Power Generation - Buck Converter; Distributor Link: www.lcsc.com; LCSC: C5156756; Rating: *; Dielectric: *
D901-D903 = D_SCHOTTKY_SOD_523: Diode Schottky SMD SOD-323; Manufacturer: STMicroelectronics; Manufacturer Part Number: BAT41KFILM; LCSC: C73150
NT901-NT903 = NetTie_SMD: Net Tie SMD
Q901 Q902 = SIR500DP-T1-RE3: MOSFET N-Channel Vds=30V Id=351A Rds=470uR; Manufacturer: Vishay; Manufacturer Part Number: SIR500DP-T1-RE3
R901 R902 = RES_0603: Resistor SMD 0603; Manufacturer: PANASONIC; Manufacturer Part Number: ERJPA3J7R5V; Distributor Link: www.lcsc.com; LCSC: C445790
R903 = RES_1206: Resistor SMD 1206; Manufacturer: Milliohm; Manufacturer Part Number: HoSRX1206-3W-0.5mR-1%; Distributor Link: www.lcsc.com; LCSC: C18724161
R904 R905 = RES_0805: Resistor SMD 0805; Manufacturer: Viking Tech; Manufacturer Part Number: ARG05FTC0220; Distributor Link: www.lcsc.com; LCSC: C218436

## Sheet Motor Control - Phase B.SchDoc: [10] Motor Control - Phase B
size A4; ApprovedBy: Nagy Richard; CheckedBy: Nagy Richard; Author: Nagy Richard; CompanyName: EmbedCore; DrawnBy: Nagy Richard; Engineer: Nagy Richard; Organization: EmbedCore; Revision: 1.0; SheetNumber: 10; SheetTotal: 25
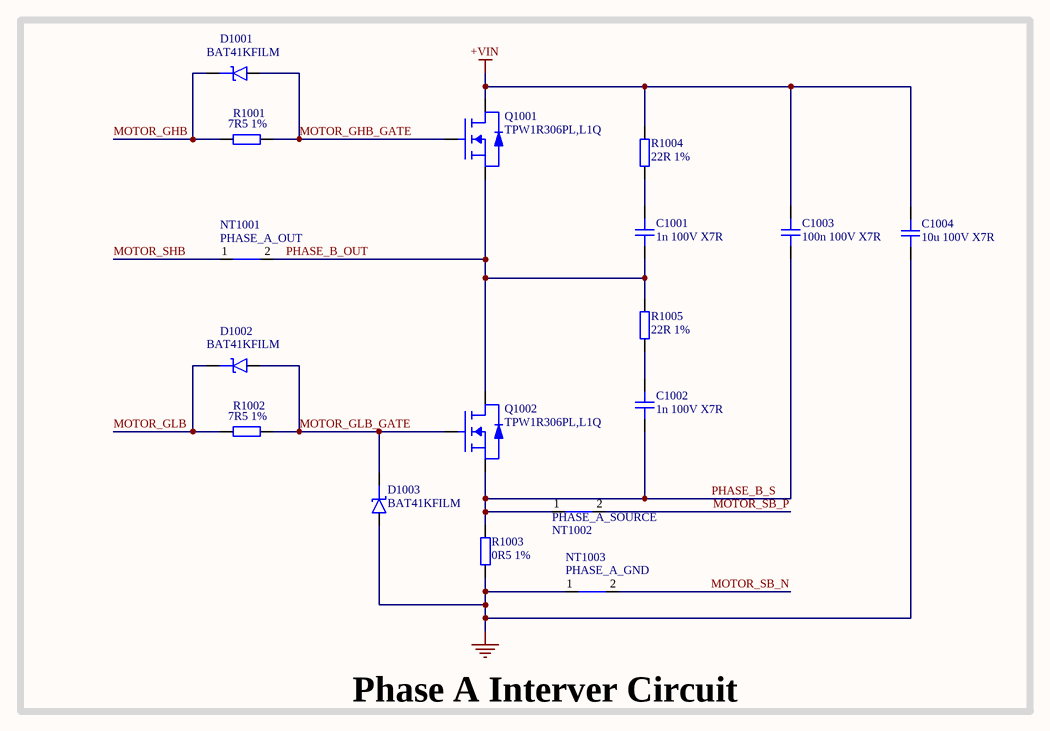
[diagram p8: Motor Control - Phase B.SchDoc]

### Parts
C1001  1n 100V X7R  [CAP_0805]
C1002  1n 100V X7R  [CAP_0805]
C1003  100n 100V X7R  [CAP_1206]
C1004  10u 100V X7R  [CAP_1210]
D1001  BAT41KFILM  [SOD-523]
D1002  BAT41KFILM  [SOD-523]
D1003  BAT41KFILM  [SOD-523]
NT1001  PHASE_A_OUT  [NETTIE_SMD]  (net tie, no BOM)
NT1002  PHASE_A_SOURCE  [NETTIE_SMD]  (net tie, no BOM)
NT1003  PHASE_A_GND  [NETTIE_SMD]  (net tie, no BOM)
Q1001  TPW1R306PL,L1Q  [PowerPAK-SO-8]
Q1002  TPW1R306PL,L1Q  [PowerPAK-SO-8]
R1001  7R5 1%  [RES_0603]
R1002  7R5 1%  [RES_0603]
R1003  0R5 1%  [RES_1206]
R1004  22R 1%  [RES_0805]
R1005  22R 1%  [RES_0805]

### Blocks framed on the sheet
Phase A Interver Circuit: C1001-C1004 D1001-D1003 NT1001-NT1003 Q1001 Q1002 R1001-R1005

### Nets
+VIN: C1003.2 C1004.2 Q1001.D R1004.2
GND: C1004.1 D1003.A NT1003.1 R1003.1
MOTOR_GHB: D1001.K R1001.1
MOTOR_GHB_GATE: D1001.A Q1001.G R1001.2
MOTOR_GLB: D1002.K R1002.1
MOTOR_GLB_GATE: D1002.A D1003.K Q1002.G R1002.2
MOTOR_SB_N: NT1003.2
MOTOR_SB_P: NT1002.2
MOTOR_SHB: NT1001.1
PHASE_B_OUT: C1001.1 NT1001.2 Q1001.S Q1002.D R1005.2
PHASE_B_S: C1002.1 C1003.1 NT1002.1 Q1002.S R1003.2
NetC1001_2: C1001.2 R1004.1
NetC1002_2: C1002.2 R1005.1

### Notes on the sheet
- Title:
- Drawn By:
- Page Contents:
- Checked By:
- Size:
- Date:
- File:
- License:
- Email:
- A4
- Number:
- Time:
- Revision:
- Sheet
- Website:
- of

### Library data of the parts
C1001 C1002 = CAP_0805: as C901 on sheet Motor Control - Phase A; Distributor Link: www.lcsc.com; LCSC: C2169492; Rating: *; Dielectric: *
C1003 = CAP_1206: as C903 on sheet Motor Control - Phase A; Distributor Link: www.lcsc.com; LCSC: C726629; Rating: *; Dielectric: *
C1004 = CAP_1210: as C519 on sheet Power Generation - Buck Converter; Distributor Link: www.lcsc.com; LCSC: C5156756; Rating: *; Dielectric: *
D1001-D1003 = D_SCHOTTKY_SOD_523: as D901 on sheet Motor Control - Phase A; Manufacturer Part Number: BAT41KFILM; LCSC: C73150
NT1001-NT1003 = NetTie_SMD: Net Tie SMD
Q1001 Q1002 = SIR500DP-T1-RE3: as Q901 on sheet Motor Control - Phase A; Manufacturer Part Number: SIR500DP-T1-RE3
R1001 R1002 = RES_0603: as R901 on sheet Motor Control - Phase A; Distributor Link: www.lcsc.com; LCSC: C445790
R1003 = RES_1206: as R903 on sheet Motor Control - Phase A; Distributor Link: www.lcsc.com; LCSC: C18724161
R1004 R1005 = RES_0805: as R904 on sheet Motor Control - Phase A; Distributor Link: www.lcsc.com; LCSC: C218436

## Sheet Motor Control - Phase C.SchDoc: [11] Motor Control - Phase C
size A4; ApprovedBy: Nagy Richard; CheckedBy: Nagy Richard; Author: Nagy Richard; CompanyName: EmbedCore; DrawnBy: Nagy Richard; Engineer: Nagy Richard; Organization: EmbedCore; Revision: 1.0; SheetNumber: 11; SheetTotal: 25
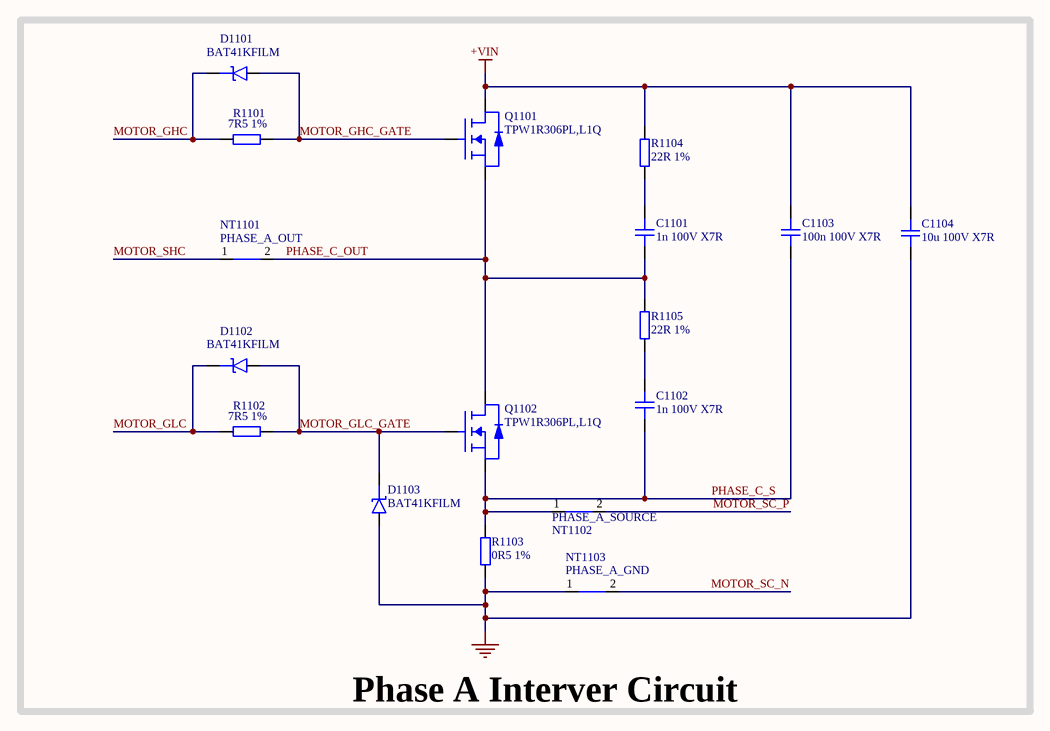
[diagram p9: Motor Control - Phase C.SchDoc]

### Parts
C1101  1n 100V X7R  [CAP_0805]
C1102  1n 100V X7R  [CAP_0805]
C1103  100n 100V X7R  [CAP_1206]
C1104  10u 100V X7R  [CAP_1210]
D1101  BAT41KFILM  [SOD-523]
D1102  BAT41KFILM  [SOD-523]
D1103  BAT41KFILM  [SOD-523]
NT1101  PHASE_A_OUT  [NETTIE_SMD]  (net tie, no BOM)
NT1102  PHASE_A_SOURCE  [NETTIE_SMD]  (net tie, no BOM)
NT1103  PHASE_A_GND  [NETTIE_SMD]  (net tie, no BOM)
Q1101  TPW1R306PL,L1Q  [PowerPAK-SO-8]
Q1102  TPW1R306PL,L1Q  [PowerPAK-SO-8]
R1101  7R5 1%  [RES_0603]
R1102  7R5 1%  [RES_0603]
R1103  0R5 1%  [RES_1206]
R1104  22R 1%  [RES_0805]
R1105  22R 1%  [RES_0805]

### Blocks framed on the sheet
Phase A Interver Circuit: C1101-C1104 D1101-D1103 NT1101-NT1103 Q1101 Q1102 R1101-R1105

### Nets
+VIN: C1103.2 C1104.2 Q1101.D R1104.2
GND: C1104.1 D1103.A NT1103.1 R1103.1
MOTOR_GHC: D1101.K R1101.1
MOTOR_GHC_GATE: D1101.A Q1101.G R1101.2
MOTOR_GLC: D1102.K R1102.1
MOTOR_GLC_GATE: D1102.A D1103.K Q1102.G R1102.2
MOTOR_SC_N: NT1103.2
MOTOR_SC_P: NT1102.2
MOTOR_SHC: NT1101.1
PHASE_C_OUT: C1101.1 NT1101.2 Q1101.S Q1102.D R1105.2
PHASE_C_S: C1102.1 C1103.1 NT1102.1 Q1102.S R1103.2
NetC1101_2: C1101.2 R1104.1
NetC1102_2: C1102.2 R1105.1

### Notes on the sheet
- Title:
- Drawn By:
- Page Contents:
- Checked By:
- Size:
- Date:
- File:
- License:
- Email:
- A4
- Number:
- Time:
- Revision:
- Sheet
- Website:
- of

### Library data of the parts
C1101 C1102 = CAP_0805: as C901 on sheet Motor Control - Phase A; Distributor Link: www.lcsc.com; LCSC: C2169492; Rating: *; Dielectric: *
C1103 = CAP_1206: as C903 on sheet Motor Control - Phase A; Distributor Link: www.lcsc.com; LCSC: C726629; Rating: *; Dielectric: *
C1104 = CAP_1210: as C519 on sheet Power Generation - Buck Converter; Distributor Link: www.lcsc.com; LCSC: C5156756; Rating: *; Dielectric: *
D1101-D1103 = D_SCHOTTKY_SOD_523: as D901 on sheet Motor Control - Phase A; Manufacturer Part Number: BAT41KFILM; LCSC: C73150
NT1101-NT1103 = NetTie_SMD: Net Tie SMD
Q1101 Q1102 = SIR500DP-T1-RE3: as Q901 on sheet Motor Control - Phase A; Manufacturer Part Number: SIR500DP-T1-RE3
R1101 R1102 = RES_0603: as R901 on sheet Motor Control - Phase A; Distributor Link: www.lcsc.com; LCSC: C445790
R1103 = RES_1206: as R903 on sheet Motor Control - Phase A; Distributor Link: www.lcsc.com; LCSC: C18724161
R1104 R1105 = RES_0805: as R904 on sheet Motor Control - Phase A; Distributor Link: www.lcsc.com; LCSC: C218436

## Sheet Sensing - Voltage.SchDoc: [12] Sensing - Voltage
size A4; ApprovedBy: Nagy Richard; CheckedBy: Nagy Richard; Author: Nagy Richard; CompanyName: EmbedCore; DrawnBy: Nagy Richard; Engineer: Nagy Richard; Organization: EmbedCore; DocumentNumber: 10; Revision: 1.0; SheetNumber: 12; SheetTotal: 13
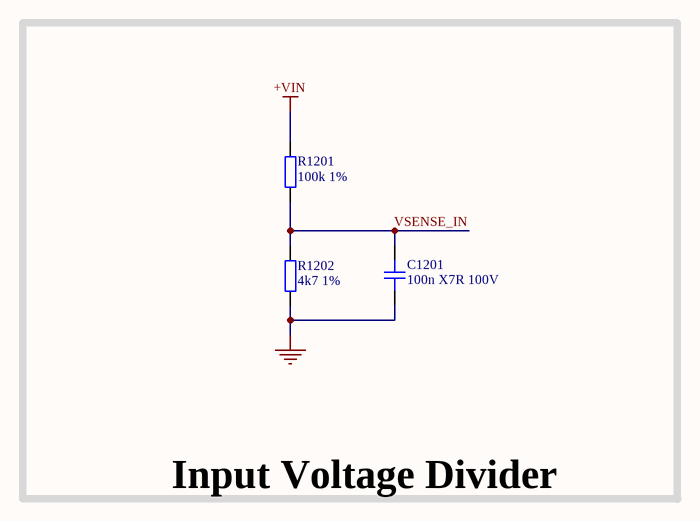
[diagram p10: Sensing - Voltage.SchDoc]

### Parts
C1201  100n X7R 100V  [CAP_0603]
R1201  100k 1%  [RES_0603]
R1202  4k7 1%  [RES_0603]

### Blocks framed on the sheet
Input Voltage Divider: C1201 R1201 R1202

### Nets
+VIN: R1201.2
GND: C1201.1 R1202.1
VSENSE_IN: C1201.2 R1201.1 R1202.2

### Notes on the sheet
- Title:
- Drawn By:
- Page Contents:
- Checked By:
- Size:
- Date:
- File:
- License:
- Email:
- A4
- Number:
- Time:
- Revision:
- Sheet
- Website:
- of

### Library data of the parts
C1201 = CAP_0603: Capacitor SMD 0603; Manufacturer: CCTC; Manufacturer Part Number: TCC0603X7R104K101CT; Distributor Link: www.lcsc.com; LCSC: C696916; Rating: *; Dielectric: *
R1201 = RES_0603: Resistor SMD 0603; Manufacturer: Vishay Intertech; Manufacturer Part Number: MCT06030C1003FP500; Distributor Link: www.lcsc.com; LCSC: C161805
R1202 = RES_0603: Resistor SMD 0603; Manufacturer: Vishay Intertech; Manufacturer Part Number: TNPW06034K70BEEA; Distributor Link: www.lcsc.com; LCSC: C844460

## Sheet Sensing - Temperature.SchDoc: [13] Sensing - Temperature
size A4; ApprovedBy: Nagy Richard; CheckedBy: Nagy Richard; Author: Nagy Richard; CompanyName: EmbedCore; DrawnBy: Nagy Richard; Engineer: Nagy Richard; Organization: EmbedCore; DocumentNumber: 13; Revision: 1.0; SheetNumber: 13; SheetTotal: 25
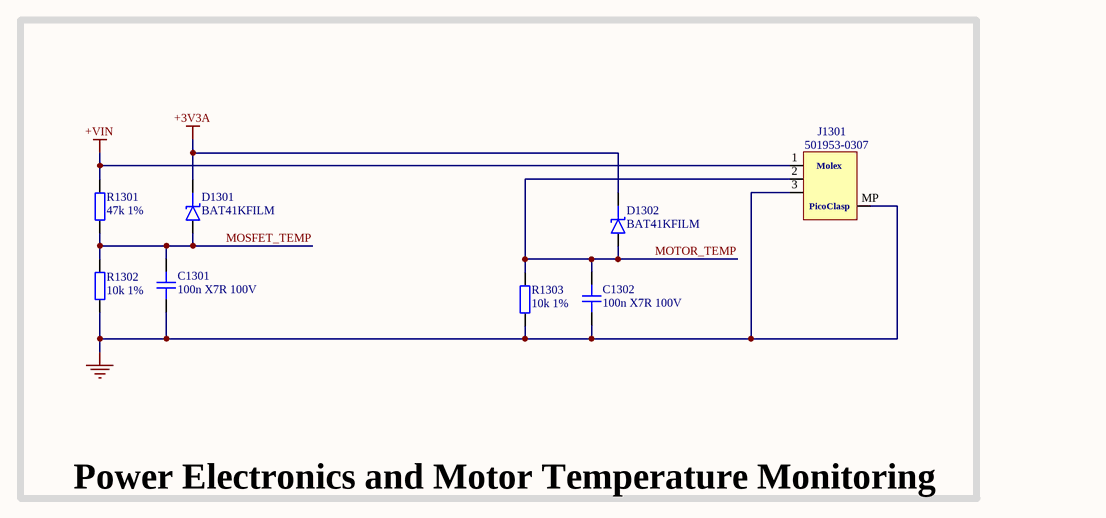
[diagram p11: Sensing - Temperature.SchDoc]

### Parts
C1301  100n X7R 100V  [CAP_0603]
C1302  100n X7R 100V  [CAP_0603]
D1301  BAT41KFILM  [SOD-523]
D1302  BAT41KFILM  [SOD-523]
J1301  501953-0307  [5019530307]
R1301  47k 1%  [RES_0603]
R1302  10k 1%  [RES_0603]
R1303  10k 1%  [RES_0603]

### Blocks framed on the sheet
Power Electronics and Motor Temperature Monitoring: C1301 C1302 D1301 D1302 J1301 R1301-R1303

### Nets
+3V3A: D1301.K D1302.K
+VIN: J1301.1 R1301.2
GND: C1301.1 C1302.1 J1301.3 J1301.MP R1302.1 R1303.1
MOSFET_TEMP: C1301.2 D1301.A R1301.1 R1302.2
MOTOR_TEMP: C1302.2 D1302.A J1301.2 R1303.2

### Notes on the sheet
- Title:
- Drawn By:
- Page Contents:
- Checked By:
- Size:
- Date:
- File:
- License:
- Email:
- A4
- Number:
- Time:
- Revision:
- Sheet
- Website:
- of
- (in symbol 501953-0307) Molex; PicoClasp

### Library data of the parts
C1301 C1302 = CAP_0603: as C1201 on sheet Sensing - Voltage; Distributor Link: www.lcsc.com; LCSC: C696916; Rating: *; Dielectric: *
D1301 D1302 = D_SCHOTTKY_SOD_523: as D901 on sheet Motor Control - Phase A; Manufacturer Part Number: BAT41KFILM; LCSC: C73150
J1301 = 501953-0307: Headers & Wire Housings 1.0WtBWaferAssyR/A1- -Row3Ckt+LKEmbsTpPkg
R1301 = RES_0603: Resistor SMD 0603; Manufacturer: Vishay Intertech; Manufacturer Part Number: NTCS0603E3473FHT; Distributor Link: www.lcsc.com; LCSC: C511055
R1302 R1303 = RES_0603: as R501 on sheet Power Generation - Buck Converter; Distributor Link: www.lcsc.com; LCSC: C185372

## Sheet Sensing - HAL Sensor.SchDoc: [15] Sensing - HAL Sensor
size A4; ApprovedBy: Nagy Richard; CheckedBy: Nagy Richard; Author: Nagy Richard; CompanyName: EmbedCore; DrawnBy: Nagy Richard; Engineer: Nagy Richard; Organization: EmbedCore; DocumentNumber: 15; Revision: 1.0; SheetNumber: 13; SheetTotal: 24
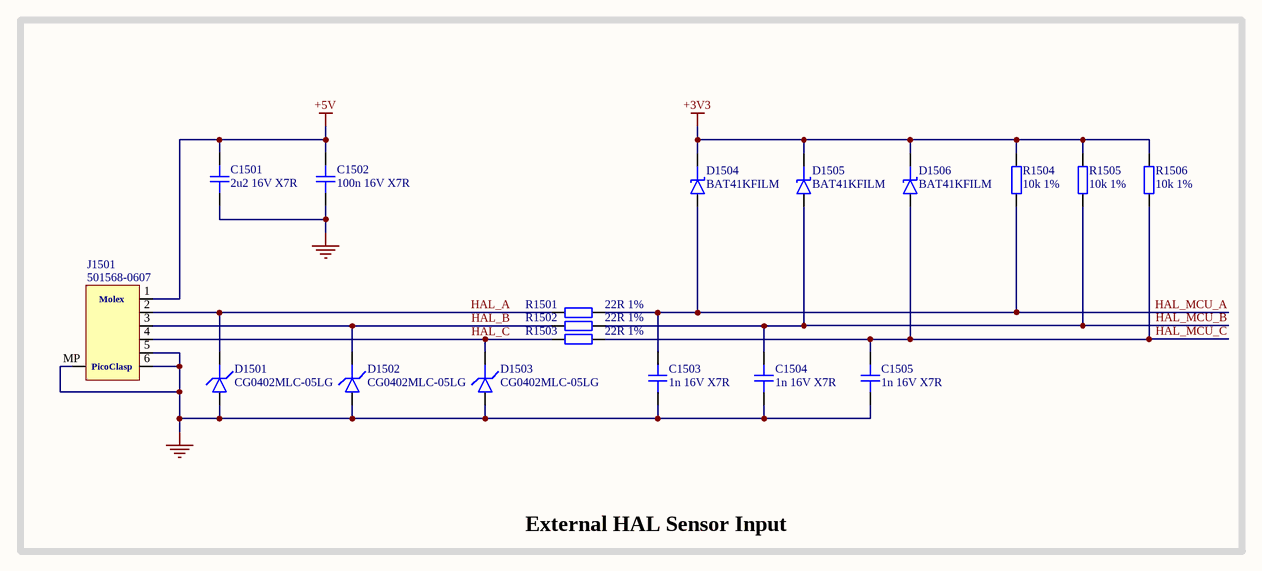
[diagram p12: Sensing - HAL Sensor.SchDoc]

### Parts
C1501  2u2 16V X7R  [CAP_0603]
C1502  100n 16V X7R  [CAP_0402]
C1503  1n 16V X7R  [CAP_0402]
C1504  1n 16V X7R  [CAP_0402]
C1505  1n 16V X7R  [CAP_0402]
D1501  CG0402MLC-05LG  [D_0402]
D1502  CG0402MLC-05LG  [D_0402]
D1503  CG0402MLC-05LG  [D_0402]
D1504  BAT41KFILM  [SOD-523]
D1505  BAT41KFILM  [SOD-523]
D1506  BAT41KFILM  [SOD-523]
J1501  501568-0607  [501568-0607]
R1501  22R 1%  [RES_0402]
R1502  22R 1%  [RES_0402]
R1503  22R 1%  [RES_0402]
R1504  10k 1%  [RES_0402]
R1505  10k 1%  [RES_0402]
R1506  10k 1%  [RES_0402]

### Blocks framed on the sheet
External HAL Sensor Input: C1501-C1505 D1501-D1506 J1501 R1501-R1506

### Nets
+3V3: D1504.K D1505.K D1506.K R1504.2 R1505.2 R1506.2
+5V: C1501.2 C1502.2 J1501.1
GND: C1501.1 C1502.1 C1503.1 C1504.1 C1505.1 D1501.A D1502.A D1503.A J1501.5 J1501.6 J1501.MP
HAL_A: D1501.K J1501.2 R1501.2
HAL_B: D1502.K J1501.3 R1502.2
HAL_C: D1503.K J1501.4 R1503.2
HAL_MCU_A: C1503.2 D1504.A R1501.1 R1504.1
HAL_MCU_B: C1504.2 D1505.A R1502.1 R1505.1
HAL_MCU_C: C1505.2 D1506.A R1503.1 R1506.1

### Notes on the sheet
- Title:
- Drawn By:
- Page Contents:
- Checked By:
- Size:
- Date:
- File:
- License:
- Email:
- A4
- Number:
- Time:
- Revision:
- Sheet
- Website:
- of
- (in symbol 501568-0607) PicoClasp

### Library data of the parts
C1501 = CAP_0603: as C701 on sheet MCU - Power and I_O; Distributor Link: www.lcsc.com; LCSC: C914769; Rating: *; Dielectric: *
C1502 = CAP_0402: as C702 on sheet MCU - Power and I_O; Distributor Link: www.lcsc.com; LCSC: C541464; Rating: *; Dielectric: *
C1503-C1505 = CAP_0402: Capacitor SMD 0402; Manufacturer: YAGEO; Manufacturer Part Number: CC0402KRX7R7BB102; Distributor Link: www.lcsc.com; LCSC: C189467; Rating: *; Dielectric: *
D1501 = D_TVS_0402: Diode TVS / ESD 0402; Manufacturer: BOURNS; Manufacturer Part Number: CG0402MLC-05LG; LCSC: C711709
D1502 D1503 = D_TVS_0402: Diode TVS / ESD 0402
D1504-D1506 = D_SCHOTTKY_SOD_523: as D901 on sheet Motor Control - Phase A; Manufacturer Part Number: BAT41KFILM; LCSC: C73150
J1501 = 501568-0607: 1.00mm Pitch, Pico-Clasp PCB Header, Single Row, Right-Angle, Surface Mount, Tin Plated, Outer Positive Lock, 6 Circuits, Natural; Manufacturer: Molex; Manufacturer Part Number: 501568-0607
R1501-R1503 = RES_0402: as R804 on sheet Motor Control - Top Level; Distributor Link: www.lcsc.com; LCSC: C427230
R1504-R1506 = RES_0402: as R701 on sheet MCU - Power and I_O; Distributor Link: www.lcsc.com; LCSC: C427247

## Sheet Interface - RS485.SchDoc: [16] Interface - RS485
size A4; ApprovedBy: Nagy Richard; CheckedBy: Nagy Richard; Author: Nagy Richard; CompanyName: EmbedCore; DrawnBy: Nagy Richard; Engineer: Nagy Richard; DocumentNumber: 16; Revision: 1.0; SheetNumber: 15; SheetTotal: 25
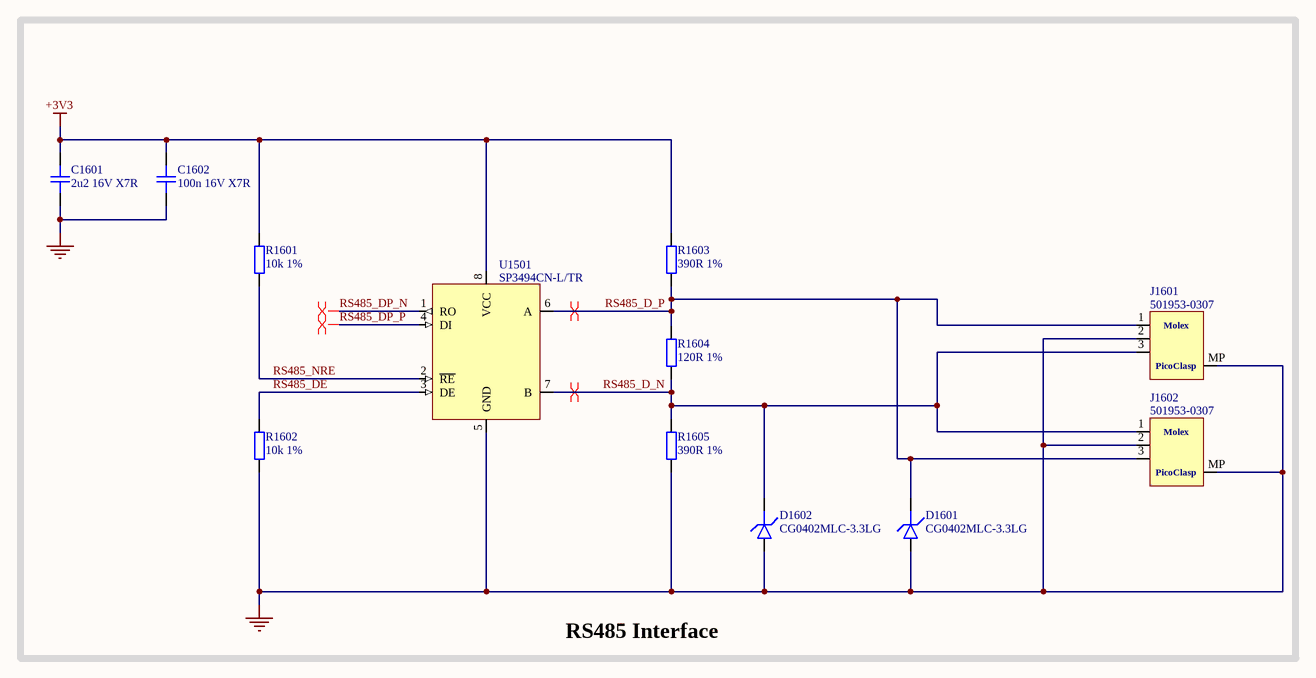
[diagram p13: Interface - RS485.SchDoc]

### Parts
C1601  2u2 16V X7R  [CAP_0603]
C1602  100n 16V X7R  [CAP_0402]
D1601  CG0402MLC-3.3LG  [D_0402]
D1602  CG0402MLC-3.3LG  [D_0402]
J1601  501953-0307  [5019530307]
J1602  501953-0307  [5019530307]
R1601  10k 1%  [RES_0402]
R1602  10k 1%  [RES_0402]
R1603  390R 1%  [RES_0402]
R1604  120R 1%  [RES_0402]
R1605  390R 1%  [RES_0402]
U1501  SP3494CN-L/TR  [SOIC-8]

### Blocks framed on the sheet
RS485 Interface: C1601 C1602 D1601 D1602 J1601 J1602 R1601-R1605 U1501

### Nets
+3V3: C1601.2 C1602.2 R1601.2 R1603.2 U1501.8(VCC)
GND: C1601.1 C1602.1 D1601.A D1602.A J1601.2 J1601.MP J1602.2 J1602.MP R1602.1 R1605.1 U1501.5(GND)
RS485_D_N: D1602.K J1601.3 J1602.1 R1604.1 R1605.2 U1501.7(B)
RS485_D_P: D1601.K J1601.1 J1602.3 R1603.1 R1604.2 U1501.6(A)
RS485_DE: R1602.2 U1501.3(DE)
RS485_DP_N: U1501.1(RO)
RS485_DP_P: U1501.4(DI)
RS485_NRE: R1601.1 U1501.2(~{RE})

### Layout directives
differential pair: RS485_D_N, RS485_D_P, RS485_DP_N, RS485_DP_P

### Notes on the sheet
- Title:
- Drawn By:
- Page Contents:
- Checked By:
- Size:
- Date:
- File:
- License:
- Email:
- A4
- Number:
- Time:
- Revision:
- Sheet
- Website:
- of
- (in symbol 501953-0307) Molex; PicoClasp

### Library data of the parts
C1601 = CAP_0603: as C701 on sheet MCU - Power and I_O; Distributor Link: www.lcsc.com; LCSC: C914769; Rating: *; Dielectric: *
C1602 = CAP_0402: as C702 on sheet MCU - Power and I_O; Distributor Link: www.lcsc.com; LCSC: C541464; Rating: *; Dielectric: *
D1601 D1602 = D_TVS_0402: Diode TVS / ESD 0402
J1601 J1602 = 501953-0307: as J1301 on sheet Sensing - Temperature
R1601 R1602 = RES_0402: as R701 on sheet MCU - Power and I_O; Distributor Link: www.lcsc.com; LCSC: C427247
R1603 R1605 = RES_0402: Resistor SMD 0402; Manufacturer: PANASONIC; Manufacturer Part Number: ERJ2GEJ391X; Distributor Link: www.lcsc.com; LCSC: C412983
R1604 = RES_0402: Resistor SMD 0402; Manufacturer: PANASONIC; Manufacturer Part Number: ERJ2GEJ121X; Distributor Link: www.lcsc.com; LCSC: C412974
U1501 = SP3494CN-L/TR: 3.3V Low Power RS-485 / RS-422 Transceiver SOIC-8; Manufacturer: MaxLinear; Manufacturer Part Number: SP3494CN-L/TR

## Sheet Interface - CAN.SchDoc: [17] Interface - CAN
size A4; ApprovedBy: Nagy Richard; CheckedBy: Nagy Richard; Author: Nagy Richard; CompanyName: EmbedCore; DrawnBy: Nagy Richard; Engineer: Nagy Richard; Organization: EmbedCore; DocumentNumber: 17; Revision: 1.0; SheetNumber: 16; SheetTotal: 25
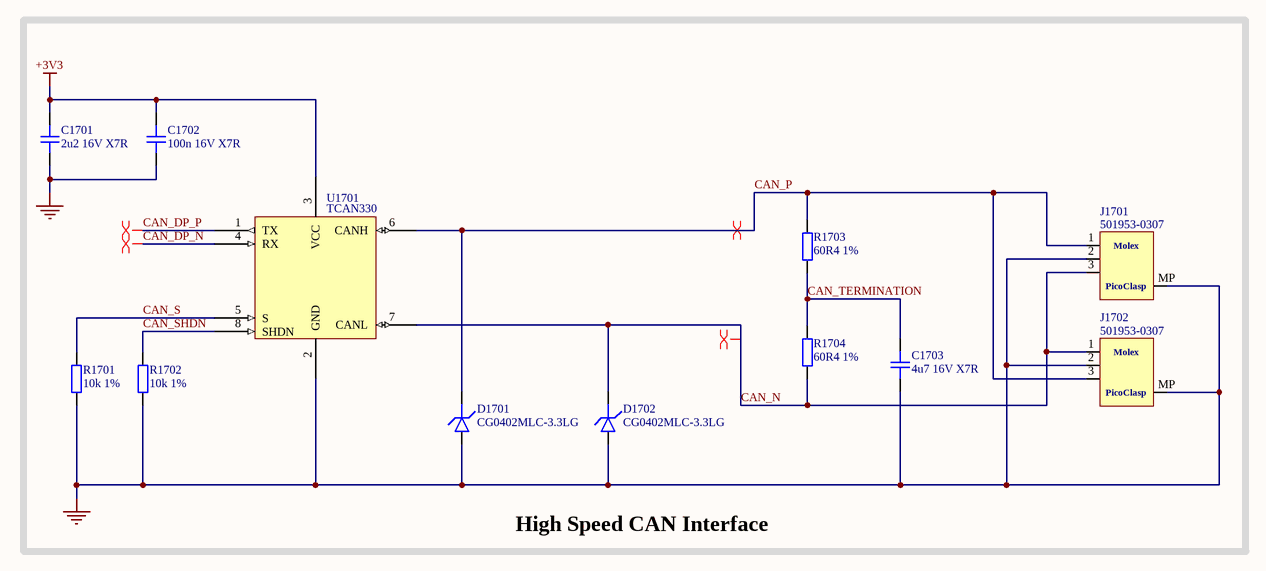
[diagram p14: Interface - CAN.SchDoc]

### Parts
C1701  2u2 16V X7R  [CAP_0603]
C1702  100n 16V X7R  [CAP_0402]
C1703  4u7 16V X7R  [CAP_0402]
D1701  CG0402MLC-3.3LG  [D_0402]
D1702  CG0402MLC-3.3LG  [D_0402]
J1701  501953-0307  [5019530307]
J1702  501953-0307  [5019530307]
R1701  10k 1%  [RES_0402]
R1702  10k 1%  [RES_0402]
R1703  60R4 1%  [RES_0402]
R1704  60R4 1%  [RES_0402]
U1701  TCAN330  [SOIC-8]

### Blocks framed on the sheet
High Speed CAN Interface: C1701-C1703 D1701 D1702 J1701 J1702 R1701-R1704 U1701

### Nets
+3V3: C1701.2 C1702.2 U1701.3(VCC)
GND: C1701.1 C1702.1 C1703.1 D1701.A D1702.A J1701.2 J1701.MP J1702.2 J1702.MP R1701.1 R1702.1 U1701.2(GND)
CAN_DP_N: U1701.4(RX)
CAN_DP_P: U1701.1(TX)
CAN_N: D1702.K J1701.3 J1702.1 R1704.1 U1701.7(CANL)
CAN_P: D1701.K J1701.1 J1702.3 R1703.2 U1701.6(CANH)
CAN_S: R1701.2 U1701.5(S)
CAN_SHDN: R1702.2 U1701.8(SHDN)
CAN_TERMINATION: C1703.2 R1703.1 R1704.2

### Layout directives
differential pair: CAN_DP_N, CAN_DP_P, CAN_N, CAN_P

### Notes on the sheet
- Title:
- Drawn By:
- Page Contents:
- Checked By:
- Size:
- Date:
- File:
- License:
- Email:
- A4
- Number:
- Time:
- Revision:
- Sheet
- Website:
- of
- (in symbol 501953-0307) Molex; PicoClasp

### Library data of the parts
C1701 = CAP_0603: as C701 on sheet MCU - Power and I_O; Distributor Link: www.lcsc.com; LCSC: C914769; Rating: *; Dielectric: *
C1702 = CAP_0402: as C702 on sheet MCU - Power and I_O; Distributor Link: www.lcsc.com; LCSC: C541464; Rating: *; Dielectric: *
C1703 = CAP_0402: Capacitor SMD 0402; Manufacturer: Murata Electronics; Manufacturer Part Number: GRM155D81C475ME15D; Distributor Link: www.lcsc.com; LCSC: C5718982; Rating: *; Dielectric: *
D1701 D1702 = D_TVS_0402: Diode TVS / ESD 0402
J1701 J1702 = 501953-0307: as J1301 on sheet Sensing - Temperature
R1701 R1702 = RES_0402: as R701 on sheet MCU - Power and I_O; Distributor Link: www.lcsc.com; LCSC: C427247
R1703 R1704 = RES_0402: Resistor SMD 0402; Manufacturer: PANASONIC; Manufacturer Part Number: ERJ2RKF60R4X; Distributor Link: www.lcsc.com; LCSC: C416565
U1701 = TCAN330: TCAN33x 3.3-V CAN Transceivers with CAN FD (Flexible Data Rate)

## Sheet Interface - USB-C.SchDoc: [18] Interface - USB-C
size A4; SheetNumber: 17; SheetTotal: 25
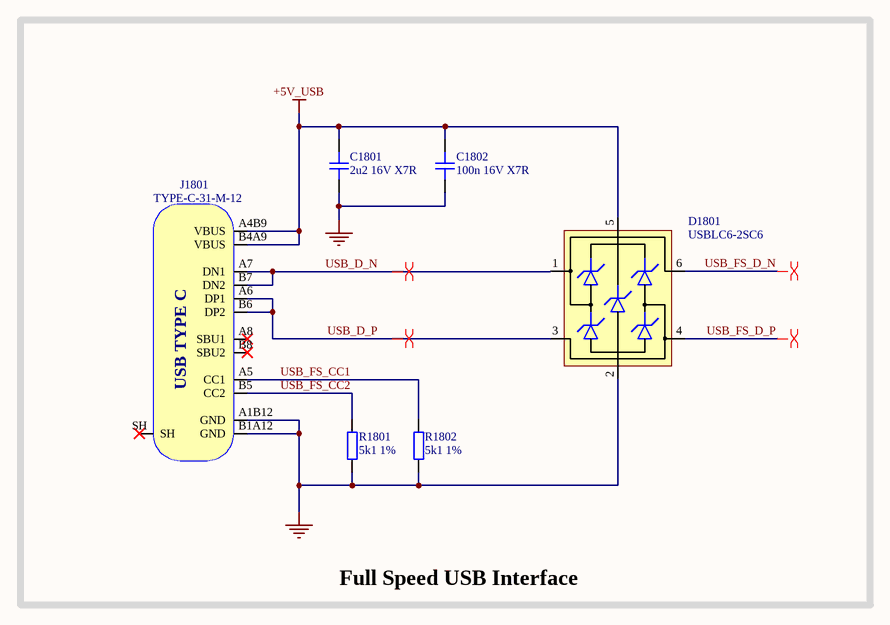
[diagram p15: Interface - USB-C.SchDoc]

### Parts
C1801  2u2 16V X7R  [CAP_0603]
C1802  100n 16V X7R  [CAP_0402]
D1801  USBLC6-2SC6  [SOT-23-6]
J1801  TYPE-C-31-M-12  [TYPE-C-31-M-12]
R1801  5k1 1%  [RES_0402]
R1802  5k1 1%  [RES_0402]

### Blocks framed on the sheet
Full Speed USB Interface: C1801 C1802 D1801 J1801 R1801 R1802

### Nets
+5V_USB: C1801.2 C1802.2 D1801.5(VBUS) J1801.A4B9(VBUS) J1801.B4A9(VBUS)
GND: C1801.1 C1802.1 D1801.2(GND) J1801.A1B12(GND) J1801.B1A12(GND) R1801.1 R1802.1
USB_D_N: D1801.1(IO1) J1801.A7(DN1) J1801.B7(DN2)
USB_D_P: D1801.3(IO2) J1801.A6(DP1) J1801.B6(DP2)
USB_FS_CC1: J1801.A5(CC1) R1802.2
USB_FS_CC2: J1801.B5(CC2) R1801.2
USB_FS_D_N: D1801.6(IO1)
USB_FS_D_P: D1801.4(IO2)

Not connected (* = marked no-connect by the designer): J1801 A8(SBU1)* B8(SBU2)* SH*

### Layout directives
differential pair: USB_D_N, USB_D_P, USB_FS_D_N, USB_FS_D_P

### Notes on the sheet
- Title:
- Drawn By:
- Page Contents:
- Checked By:
- Size:
- Date:
- File:
- License:
- Email:
- A4
- Number:
- Time:
- Revision:
- Sheet
- Website:
- of
- (in symbol TYPE-C-31-M-12) USB TYPE C

### Library data of the parts
C1801 = CAP_0603: as C701 on sheet MCU - Power and I_O; Distributor Link: www.lcsc.com; LCSC: C914769; Rating: *; Dielectric: *
C1802 = CAP_0402: as C702 on sheet MCU - Power and I_O; Distributor Link: www.lcsc.com; LCSC: C541464; Rating: *; Dielectric: *
D1801 = USBLC6-2SC6: Low-Capacitance ESD Protection USB; Manufacturer: STMicroelectronics; Manufacturer Part Number: USBLC6-2SC6; Distributor Link: https://www.mouser.de/ProductDetail/STMicroelectronics/USBLC6-2SC6?qs=po45yt2pPpu%2FhNIlwQdTlg%3D%3D
J1801 = TYPE-C-31-M-12: USB Type C Connector Horizontal SMT; Manufacturer: Koren Hroparts; Manufacturer Part Number: TYPE-C-31-M-12
R1801 R1802 = RES_0402: Resistor SMD 0402; Manufacturer: PANASONIC; Manufacturer Part Number: ERJ2GEJ512X; Distributor Link: www.lcsc.com; LCSC: C413002

## Sheet Interface - SWD.SchDoc: [19] Interface - SWD
size A4; SheetNumber: 19; SheetTotal: 26
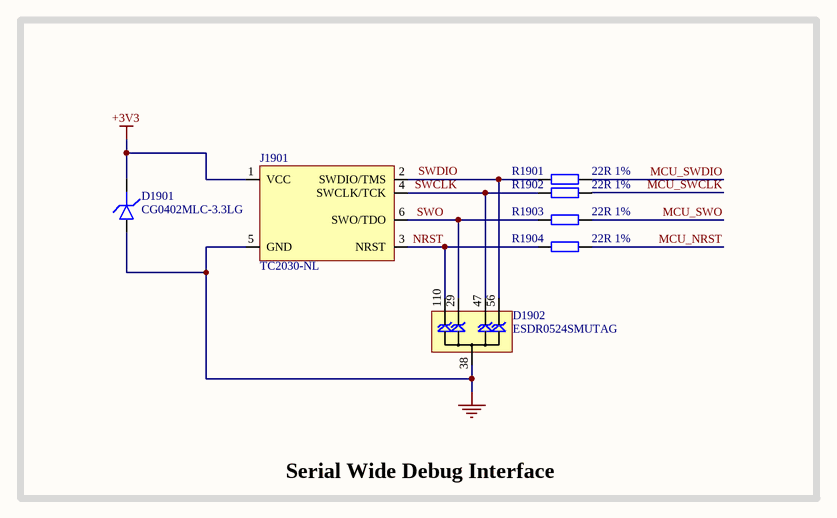
[diagram p16: Interface - SWD.SchDoc]

### Parts
D1901  CG0402MLC-3.3LG  [D_0402]
D1902  ESDR0524SMUTAG  [uDFN-10-WIDE]
J1901  TC2030-NL  [TC2030-NL-FP]  (no BOM)
R1901  22R 1%  [RES_0402]
R1902  22R 1%  [RES_0402]
R1903  22R 1%  [RES_0402]
R1904  22R 1%  [RES_0402]

### Blocks framed on the sheet
Serial Wide Debug Interface: D1901 D1902 J1901 R1901-R1904

### Nets
+3V3: D1901.K J1901.1(VCC)
GND: D1901.A D1902.38(GND) J1901.5(GND)
MCU_NRST: R1904.1
MCU_SWCLK: R1902.1
MCU_SWDIO: R1901.1
MCU_SWO: R1903.1
NRST: D1902.110 J1901.3(NRST) R1904.2
SWCLK: D1902.47 J1901.4(SWCLK/TCK) R1902.2
SWDIO: D1902.56 J1901.2(SWDIO/TMS) R1901.2
SWO: D1902.29 J1901.6(SWO/TDO) R1903.2

### Notes on the sheet
- Title:
- Drawn By:
- Page Contents:
- Checked By:
- Size:
- Date:
- File:
- License:
- Email:
- A4
- Number:
- Time:
- Revision:
- Sheet
- Website:
- of

### Library data of the parts
D1901 = D_TVS_0402: Diode TVS / ESD 0402
D1902 = ESDR0524SMUTAG: TVS Diode Array Low Capacitance ESD Protection 4-Channel (Vwork=5V, Vclamp=15V); Manufacturer: onsemi; Manufacturer Part Number: ESDR0524SMUTAG; Distributor Link: https://www.mouser.de/ProductDetail/onsemi/ESDR0524SMUTAG?qs=NJQfjRgVp6Qe%2FuopsuIgOg%3D%3D; LCSC: C890633
J1901 = TC2030-NL: Tag-Connect No-Solder SWD Debug Connector (No Legs) DO NOT PLACE; Manufacturer: Tag-Connect; Manufacturer Part Number: TC2030-NL-FP
R1901-R1904 = RES_0402: as R804 on sheet Motor Control - Top Level; Distributor Link: www.lcsc.com; LCSC: C427230

## Sheet Interface - Fan Control.SchDoc: [20] Interface - Fan Control
size A3; ApprovedBy: Nagy Richard; CheckedBy: Nagy Richard; Author: Nagy Richard; CompanyName: EmbedCore; DrawnBy: Nagy Richard; Engineer: Nagy Richard; Organization: EmbedCore; DocumentNumber: 20; Revision: 1.0; SheetNumber: 19; SheetTotal: 25
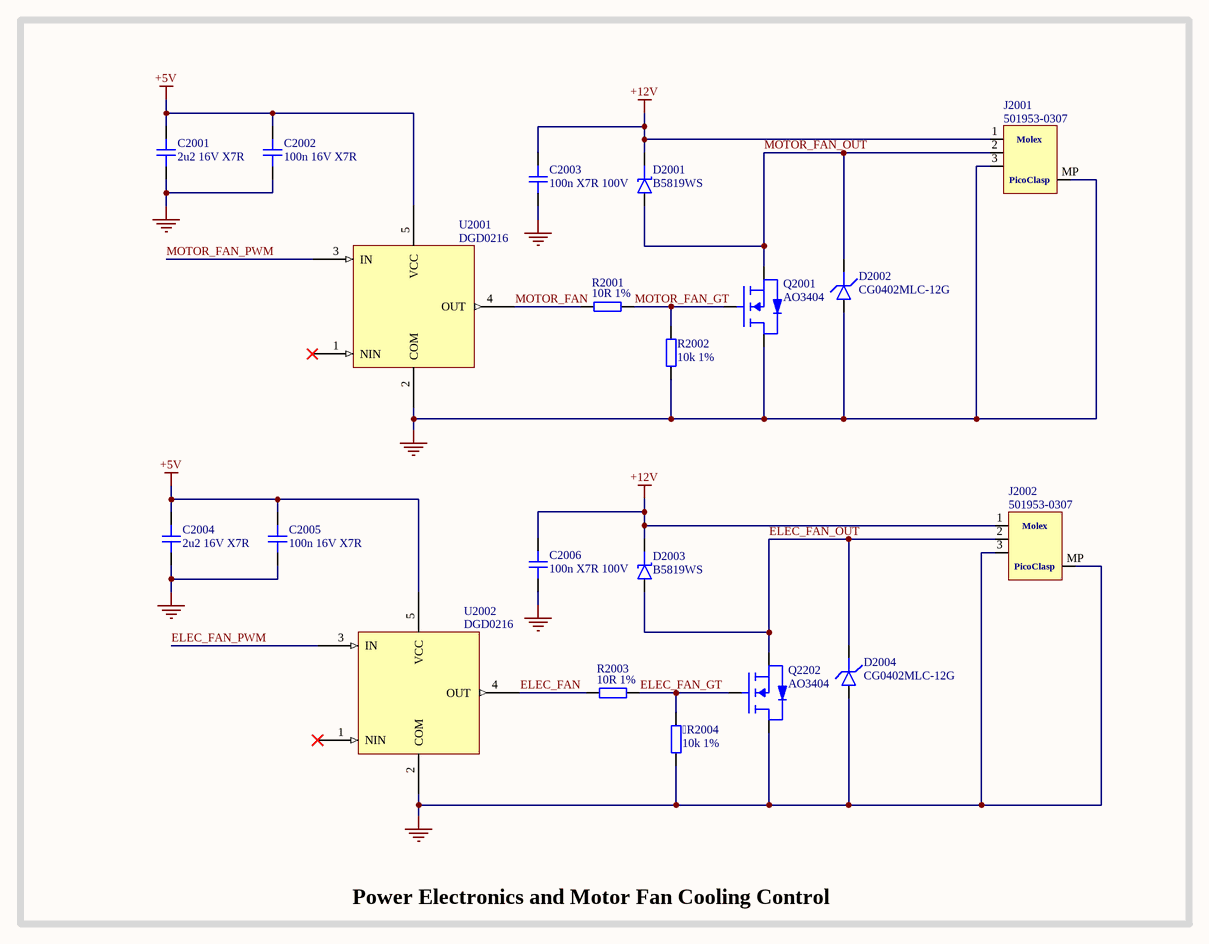
[diagram p17: Interface - Fan Control.SchDoc]

### Parts
R2004  10k 1%  [RES_0402]
C2001  2u2 16V X7R  [CAP_0603]
C2002  100n 16V X7R  [CAP_0402]
C2003  100n X7R 100V  [CAP_0603]
C2004  2u2 16V X7R  [CAP_0603]
C2005  100n 16V X7R  [CAP_0402]
C2006  100n X7R 100V  [CAP_0603]
D2001  B5819WS  [SOD-323]
D2002  CG0402MLC-12G  [D_0402]
D2003  B5819WS  [SOD-323]
D2004  CG0402MLC-12G  [D_0402]
J2001  501953-0307  [5019530307]
J2002  501953-0307  [5019530307]
Q2001  AO3404  [SSM3J338R,LF-SOT23-F]
Q2202  AO3404  [SSM3J338R,LF-SOT23-F]
R2001  10R 1%  [RES_0402]
R2002  10k 1%  [RES_0402]
R2003  10R 1%  [RES_0402]
U2001  DGD0216  [TSOT25]
U2002  DGD0216  [TSOT25]

### Blocks framed on the sheet
Power Electronics and Motor Fan Cooling Control: R2004 C2001-C2006 D2001-D2004 J2001 J2002 Q2001 Q2202 R2001-R2003 U2001 U2002

### Nets
+5V: C2001.2 C2002.2 C2004.2 C2005.2 U2001.5(VCC) U2002.5(VCC)
+12V: C2003.2 C2006.2 D2001.K D2003.K J2001.1 J2002.1
GND: R2004.1 C2001.1 C2002.1 C2003.1 C2004.1 C2005.1 C2006.1 D2002.A D2004.A J2001.3 J2001.MP J2002.3 J2002.MP Q2001.D Q2202.D R2002.1 U2001.2(COM) U2002.2(COM)
ELEC_FAN: R2003.2 U2002.4(OUT)
ELEC_FAN_GT: R2004.2 Q2202.G R2003.1
ELEC_FAN_OUT: D2003.A D2004.K J2002.2 Q2202.S
ELEC_FAN_PWM: U2002.3(IN)
MOTOR_FAN: R2001.2 U2001.4(OUT)
MOTOR_FAN_GT: Q2001.G R2001.1 R2002.2
MOTOR_FAN_OUT: D2001.A D2002.K J2001.2 Q2001.S
MOTOR_FAN_PWM: U2001.3(IN)

Not connected (* = marked no-connect by the designer): U2001 1(NIN)*; U2002 1(NIN)*

### Notes on the sheet
- Title:
- Drawn By:
- Page Contents:
- Checked By:
- Size:
- Date:
- File:
- License:
- Email:
- A4
- Number:
- Time:
- Revision:
- Sheet
- Website:
- of
- (in symbol 501953-0307) Molex; PicoClasp

### Library data of the parts
R2004 R2002 = RES_0402: as R701 on sheet MCU - Power and I_O; Distributor Link: www.lcsc.com; LCSC: C427247
C2001 C2004 = CAP_0603: as C701 on sheet MCU - Power and I_O; Distributor Link: www.lcsc.com; LCSC: C914769; Rating: *; Dielectric: *
C2002 C2005 = CAP_0402: as C702 on sheet MCU - Power and I_O; Distributor Link: www.lcsc.com; LCSC: C541464; Rating: *; Dielectric: *
C2003 C2006 = CAP_0603: as C1201 on sheet Sensing - Voltage; Distributor Link: www.lcsc.com; LCSC: C696916; Rating: *; Dielectric: *
D2001 D2003 = D_SCHOTTKY_SOD_323: Diode Schottky SMD SOD-323
D2002 D2004 = D_TVS_0402: Diode TVS / ESD 0402
J2001 J2002 = 501953-0307: as J1301 on sheet Sensing - Temperature
Q2001 Q2202 = 2N7002NXAKR: MOSFET N-Channel Vds=60V Id=300mA with ESD Protection; Manufacturer: TECH PUBLIC; Manufacturer Part Number: AO3404
R2001 R2003 = RES_0402: Resistor SMD 0402; Manufacturer: PANASONIC; Manufacturer Part Number: ERJPA2J100X; Distributor Link: www.lcsc.com; LCSC: C427198
U2001 U2002 = DGD0216: 1.5A HIGH SPEED SINGLE GATE DRIVER; Manufacturer: *; Manufacturer Part Number: *; LCSC: *

## Sheet Interface - BLDC Connection.SchDoc: [21] Interface - BLDC Connection
size A4; ApprovedBy: Nagy Richard; CheckedBy: Nagy Richard; Author: Nagy Richard; CompanyName: EmbedCore; DrawnBy: Nagy Richard; Engineer: Nagy Richard; Organization: EmbedCore; DocumentNumber: 21; Revision: 1.0; SheetNumber: 21; SheetTotal: 21
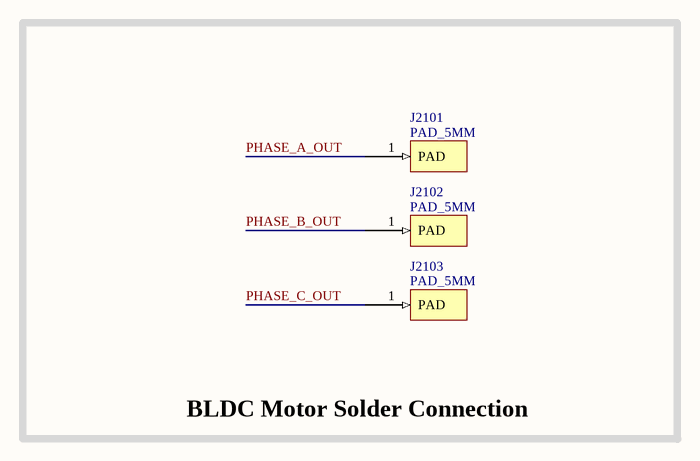
[diagram p18: Interface - BLDC Connection.SchDoc]

### Parts
J2101  PAD_5MM  [PAD_5MM]
J2102  PAD_5MM  [PAD_5MM]
J2103  PAD_5MM  [PAD_5MM]

### Blocks framed on the sheet
BLDC Motor Solder Connection: J2101-J2103

### Nets
PHASE_A_OUT: J2101.1(PAD)
PHASE_B_OUT: J2102.1(PAD)
PHASE_C_OUT: J2103.1(PAD)

### Notes on the sheet
- Title:
- Drawn By:
- Page Contents:
- Checked By:
- Size:
- Date:
- File:
- License:
- Email:
- A4
- Number:
- Time:
- Revision:
- Sheet
- Website:
- of